# Altium project 16SoundsUSB.PrjPCB (part 1 of 2)
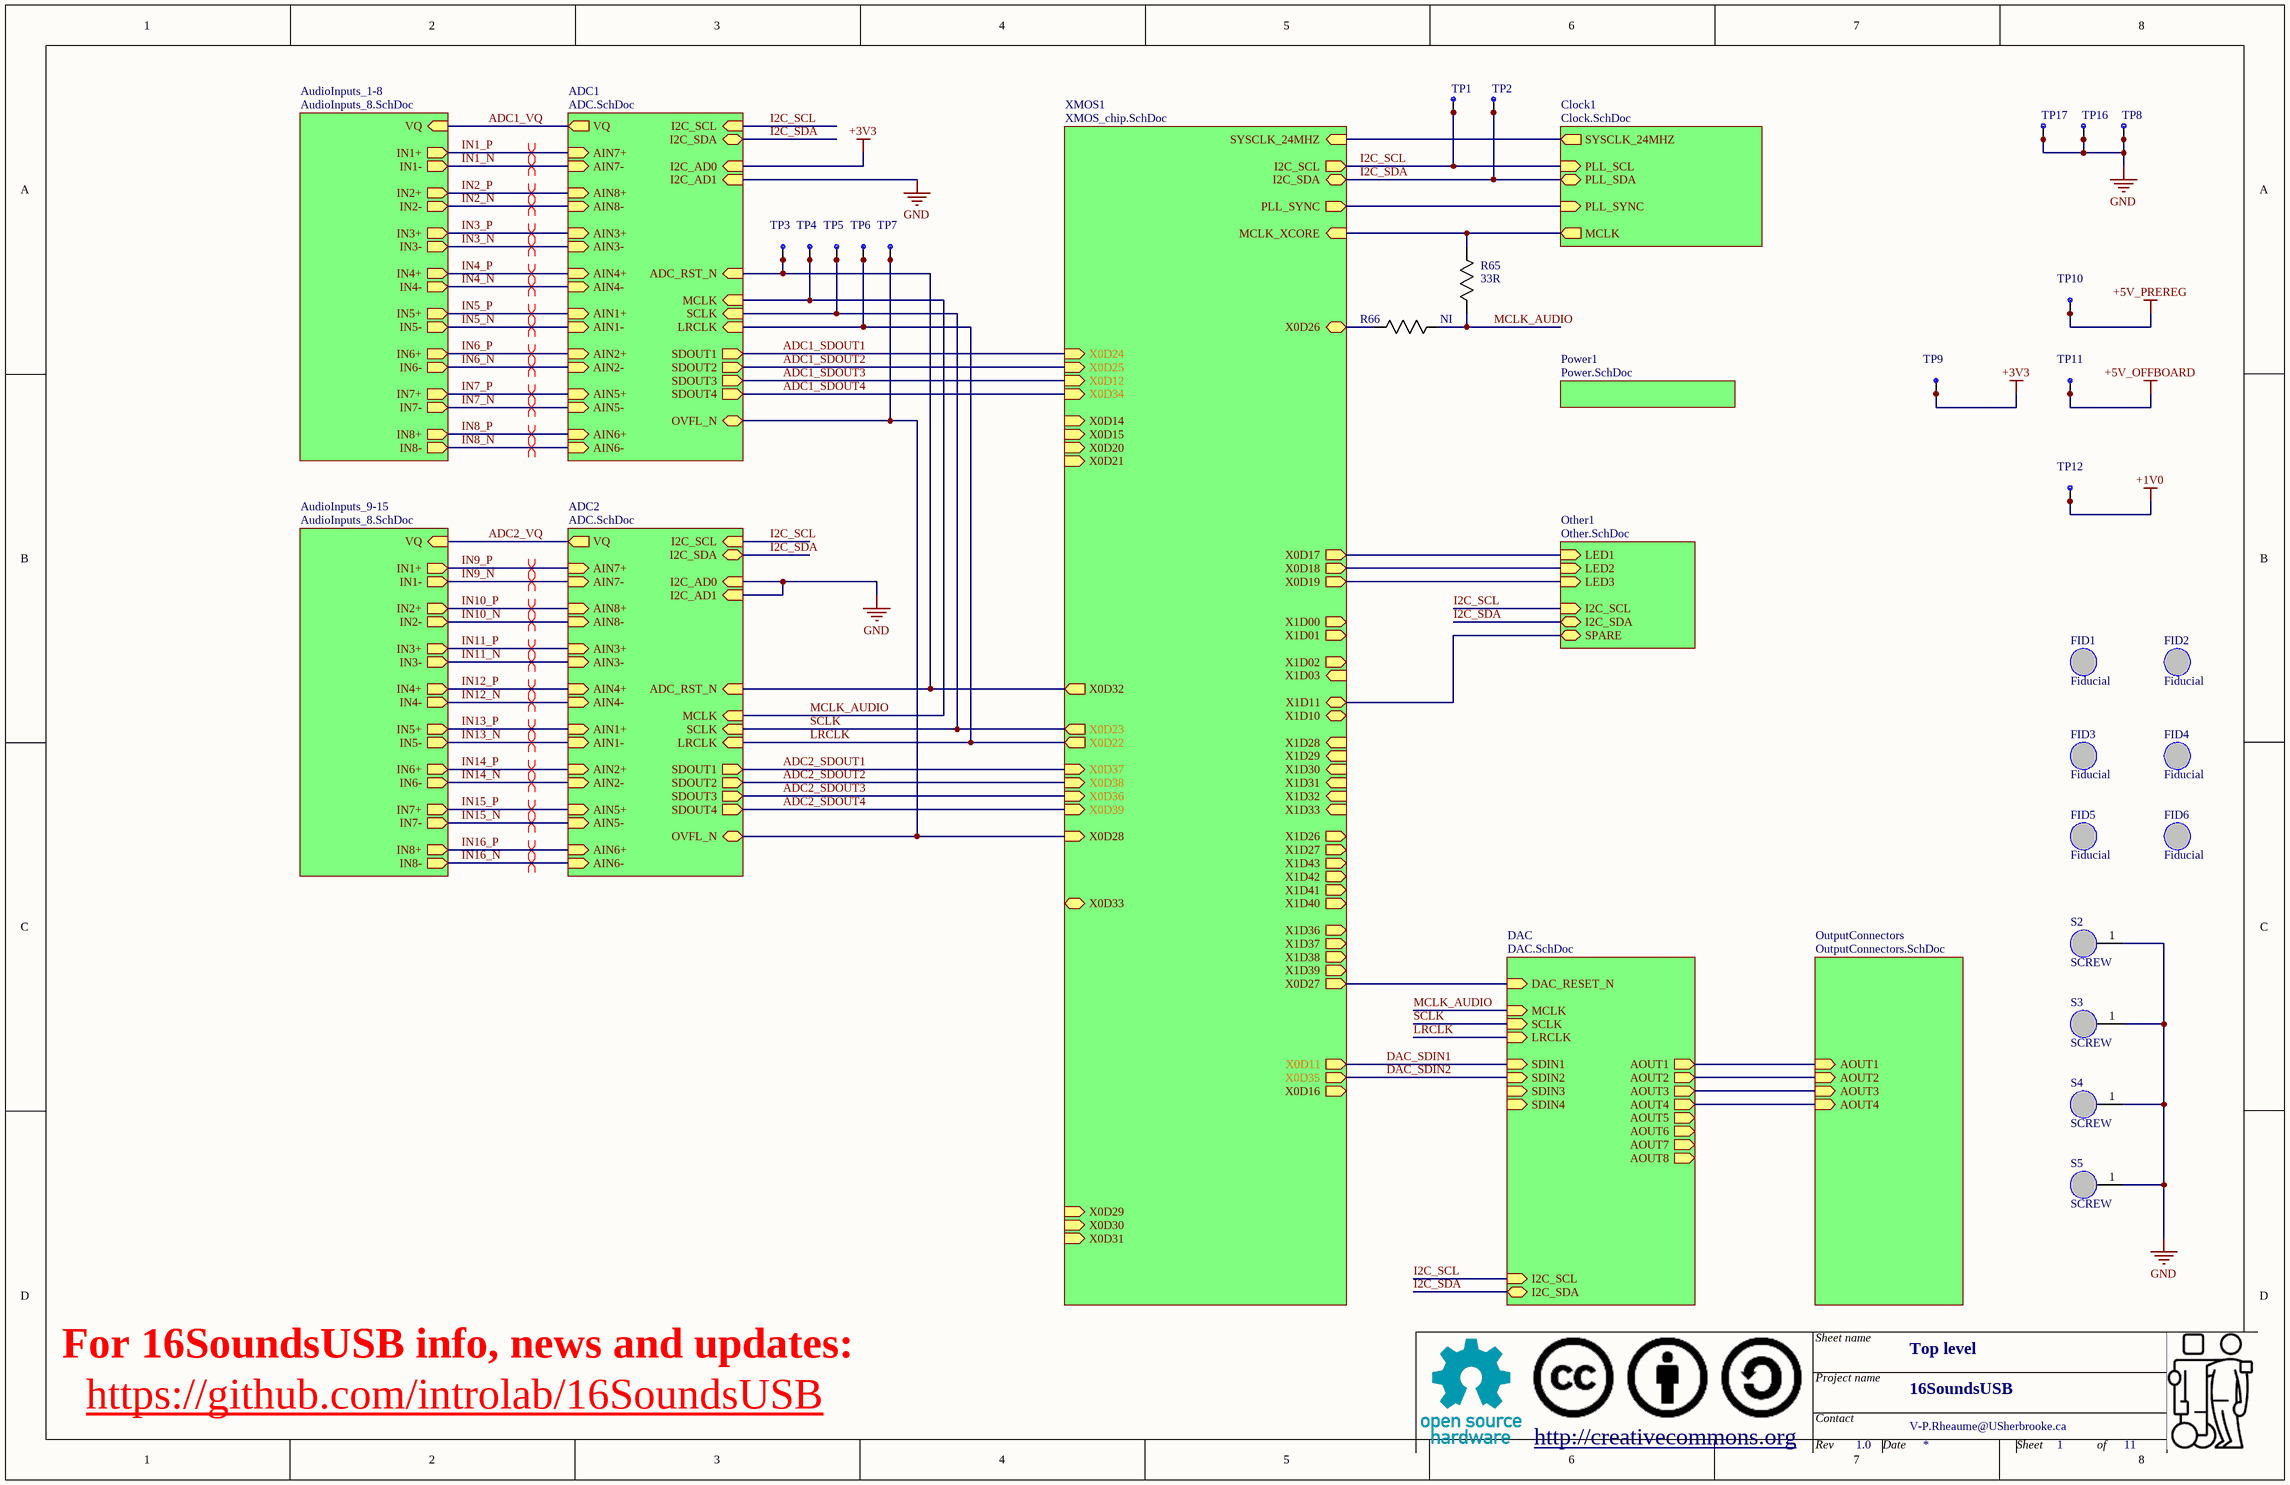
[diagram p0: TopLevel.SchDoc]
DrawnByGlobal: V-P.Rheaume@USherbrooke.ca; ProjectTitle: 16SoundsUSB; RevisionGlobal: 1.0
11 sheets, 583 parts. Net scope: hierarchical (ports join the sheet entries above them; power ports are global).
Board file: 16SoundsUSB.PcbDoc
Sheets:
  TopLevel.SchDoc
    Power1 = Power.SchDoc
    XMOS1 = XMOS_chip.SchDoc
      XMOS_power = XMOS_power.SchDoc
    AudioInputs_9-15 = AudioInputs_8.SchDoc
      InputAmplifier1 = InputAmplifier.SchDoc
      InputAmplifier2 = InputAmplifier.SchDoc
      InputAmplifier3 = InputAmplifier.SchDoc
      InputAmplifier4 = InputAmplifier.SchDoc
      InputAmplifier5 = InputAmplifier.SchDoc
      InputAmplifier6 = InputAmplifier.SchDoc
      InputAmplifier7 = InputAmplifier.SchDoc
      InputAmplifier8 = InputAmplifier.SchDoc
    Clock1 = Clock.SchDoc
    AudioInputs_1-8 = AudioInputs_8.SchDoc
      InputAmplifier1 = InputAmplifier.SchDoc
      InputAmplifier2 = InputAmplifier.SchDoc
      InputAmplifier3 = InputAmplifier.SchDoc
      InputAmplifier4 = InputAmplifier.SchDoc
      InputAmplifier5 = InputAmplifier.SchDoc
      InputAmplifier6 = InputAmplifier.SchDoc
      InputAmplifier7 = InputAmplifier.SchDoc
      InputAmplifier8 = InputAmplifier.SchDoc
    ADC2 = ADC.SchDoc
    ADC1 = ADC.SchDoc
    DAC = DAC.SchDoc
    OutputConnectors = OutputConnectors.SchDoc
    Other1 = Other.SchDoc

## Sheet TopLevel.SchDoc
size Tabloid; DrawnBy: V-P.Rheaume@USherbrooke.ca; DocumentNumber: 1; Revision: 1; SheetNumber: 1; SheetTotal: 11; SheetName: Top level

### Parts
FID1  Fiducial  [FIDUCIAL]
FID2  Fiducial  [FIDUCIAL]
FID3  Fiducial  [FIDUCIAL]
FID4  Fiducial  [FIDUCIAL]
FID5  Fiducial  [FIDUCIAL]
FID6  Fiducial  [FIDUCIAL]
R65  value 33R  [0603]  (hidden comment: Resistor)
R66  Resistor  [0603]  (value not drawn)
S2  SCREW  [SCREW_4_40]
S3  SCREW  [SCREW_4_40]
S4  SCREW  [SCREW_4_40]
S5  SCREW  [SCREW_4_40]
TP1  TESTPOINT  [0603]  (value not drawn)
TP2  TESTPOINT  [0603]  (value not drawn)
TP3  TESTPOINT  [0603]  (value not drawn)
TP4  TESTPOINT  [0603]  (value not drawn)
TP5  TESTPOINT  [0603]  (value not drawn)
TP6  TESTPOINT  [0603]  (value not drawn)
TP7  TESTPOINT  [0603]  (value not drawn)
TP8  TESTPOINT  [1206]  (value not drawn)
TP9  TESTPOINT  [0603]  (value not drawn)
TP10  TESTPOINT  [0603]  (value not drawn)
TP11  TESTPOINT  [0603]  (value not drawn)
TP12  TESTPOINT  [0603]  (value not drawn)
TP16  TESTPOINT  [1206]  (value not drawn)
TP17  TESTPOINT  [1206]  (value not drawn)

### Sub-sheets
ADC1 = ADC.SchDoc: I2C_SCL (in), I2C_SDA (bidir), I2C_AD1 (in), I2C_AD0 (in), SDOUT1 (out), SDOUT2 (out), SDOUT3 (out), SDOUT4 (out), LRCLK (in), SCLK (in), MCLK (in), ADC_RST_N (in), OVFL_N (bidir), AIN1+ (in), AIN1- (in), AIN2+ (in), AIN2- (in), AIN3+ (in), AIN3- (in), AIN4+ (in), AIN4- (in), AIN5+ (in), AIN5- (in), AIN6+ (in), AIN6- (in), AIN7+ (in), AIN7- (in), AIN8+ (in), AIN8- (in), VQ (out)
ADC2 = ADC.SchDoc: I2C_SCL (in), I2C_SDA (bidir), I2C_AD1 (in), I2C_AD0 (in), SDOUT1 (out), SDOUT2 (out), SDOUT3 (out), SDOUT4 (out), LRCLK (in), SCLK (in), MCLK (in), ADC_RST_N (in), OVFL_N (bidir), AIN1+ (in), AIN1- (in), AIN2+ (in), AIN2- (in), AIN3+ (in), AIN3- (in), AIN4+ (in), AIN4- (in), AIN5+ (in), AIN5- (in), AIN6+ (in), AIN6- (in), AIN7+ (in), AIN7- (in), AIN8+ (in), AIN8- (in), VQ (out)
AudioInputs_1-8 = AudioInputs_8.SchDoc: VQ (in), IN8+ (out), IN8- (out), IN1+ (out), IN1- (out), IN2+ (out), IN2- (out), IN3+ (out), IN3- (out), IN4+ (out), IN4- (out), IN5+ (out), IN5- (out), IN6+ (out), IN6- (out), IN7+ (out), IN7- (out)
AudioInputs_9-15 = AudioInputs_8.SchDoc: VQ (in), IN8+ (out), IN8- (out), IN1+ (out), IN1- (out), IN2+ (out), IN2- (out), IN3+ (out), IN3- (out), IN4+ (out), IN4- (out), IN5+ (out), IN5- (out), IN6+ (out), IN6- (out), IN7+ (out), IN7- (out)
Clock1 = Clock.SchDoc: SYSCLK_24MHZ (out), PLL_SYNC (in), PLL_SCL (in), PLL_SDA (bidir), MCLK (out)
DAC = DAC.SchDoc: LRCLK (in), SCLK (in), MCLK (in), SDIN1 (in), SDIN2 (in), SDIN3 (in), SDIN4 (in), DAC_RESET_N (in), I2C_SCL (in), I2C_SDA (bidir), AOUT1 (out), AOUT2 (out), AOUT3 (out), AOUT4 (out), AOUT5 (out), AOUT6 (out), AOUT7 (out), AOUT8 (out)
Other1 = Other.SchDoc: LED1 (in), LED2 (in), LED3 (in), I2C_SCL (in), I2C_SDA (bidir), SPARE (bidir)
OutputConnectors = OutputConnectors.SchDoc: AOUT1 (in), AOUT2 (in), AOUT3 (in), AOUT4 (in)
Power1 = Power.SchDoc: no entries
XMOS1 = XMOS_chip.SchDoc: SYSCLK_24MHZ (in), MCLK_XCORE (in), I2C_SCL (out), I2C_SDA (bidir), PLL_SYNC (out), X0D14 (in), X0D15 (in), X0D16 (out), X0D17 (out), X0D18 (out), X0D19 (out), X0D20 (in), X0D21 (in), X0D22 (out), X0D23 (out), X0D24 (in), X0D25 (in), X0D27 (out), X0D32 (out), X0D34 (in), X0D35 (out), X0D36 (in), X0D37 (in), X0D38 (in), X0D39 (in), X0D29 (in), X0D28 (in), X0D31 (in), X0D30 (in), X0D33 (bidir), X0D26 (bidir), X1D26 (out), X1D27 (out), X1D28 (in), X1D29 (in), X1D30 (in), X1D31 (in), X1D32 (in), X1D33 (in), X1D43 (out), X1D42 (out), X1D41 (out), X1D40 (out), X1D10 (bidir), X1D11 (bidir), X1D03 (in), X1D02 (out), X1D01 (out), X1D00 (out), X1D37 (out), X1D36 (out), X1D39 (out), X1D38 (out), X0D12 (in), X0D11 (out)

### Nets
+1V0: TP12.1 TP12.2
+3V3: TP9.1 TP9.2 ; sheet ADC1/I2C_AD0
+5V_OFFBOARD: TP11.1 TP11.2
+5V_PREREG: TP10.1 TP10.2
GND: S2.1 S3.1 S4.1 S5.1 TP8.1 TP8.2 TP16.1 TP16.2 TP17.1 TP17.2 ; sheet ADC2/I2C_AD1, sheet ADC2/I2C_AD0, sheet ADC1/I2C_AD1
ADC1_SDOUT1: sheet XMOS1/X0D24, sheet ADC1/SDOUT1
ADC1_SDOUT2: sheet XMOS1/X0D25, sheet ADC1/SDOUT2
ADC1_SDOUT3: sheet XMOS1/X0D12, sheet ADC1/SDOUT3
ADC1_SDOUT4: sheet XMOS1/X0D34, sheet ADC1/SDOUT4
ADC1_VQ: sheet AudioInputs_1-8/VQ, sheet ADC1/VQ
ADC2_SDOUT1: sheet XMOS1/X0D37, sheet ADC2/SDOUT1
ADC2_SDOUT2: sheet XMOS1/X0D38, sheet ADC2/SDOUT2
ADC2_SDOUT3: sheet XMOS1/X0D36, sheet ADC2/SDOUT3
ADC2_SDOUT4: sheet XMOS1/X0D39, sheet ADC2/SDOUT4
ADC2_VQ: sheet AudioInputs_9-15/VQ, sheet ADC2/VQ
DAC_SDIN1: sheet XMOS1/X0D11, sheet DAC/SDIN1
DAC_SDIN2: sheet XMOS1/X0D35, sheet DAC/SDIN2
I2C_SCL: TP1.1 TP1.2 ; sheet XMOS1/I2C_SCL, sheet Clock1/PLL_SCL, sheet ADC2/I2C_SCL, sheet ADC1/I2C_SCL, sheet DAC/I2C_SCL, sheet Other1/I2C_SCL
I2C_SDA: TP2.1 TP2.2 ; sheet XMOS1/I2C_SDA, sheet Clock1/PLL_SDA, sheet ADC2/I2C_SDA, sheet ADC1/I2C_SDA, sheet DAC/I2C_SDA, sheet Other1/I2C_SDA
IN1_N: sheet AudioInputs_1-8/IN1-, sheet ADC1/AIN7-
IN1_P: sheet AudioInputs_1-8/IN1+, sheet ADC1/AIN7+
IN2_N: sheet AudioInputs_1-8/IN2-, sheet ADC1/AIN8-
IN2_P: sheet AudioInputs_1-8/IN2+, sheet ADC1/AIN8+
IN3_N: sheet AudioInputs_1-8/IN3-, sheet ADC1/AIN3-
IN3_P: sheet AudioInputs_1-8/IN3+, sheet ADC1/AIN3+
IN4_N: sheet AudioInputs_1-8/IN4-, sheet ADC1/AIN4-
IN4_P: sheet AudioInputs_1-8/IN4+, sheet ADC1/AIN4+
IN5_N: sheet AudioInputs_1-8/IN5-, sheet ADC1/AIN1-
IN5_P: sheet AudioInputs_1-8/IN5+, sheet ADC1/AIN1+
IN6_N: sheet AudioInputs_1-8/IN6-, sheet ADC1/AIN2-
IN6_P: sheet AudioInputs_1-8/IN6+, sheet ADC1/AIN2+
IN7_N: sheet AudioInputs_1-8/IN7-, sheet ADC1/AIN5-
IN7_P: sheet AudioInputs_1-8/IN7+, sheet ADC1/AIN5+
IN8_N: sheet AudioInputs_1-8/IN8-, sheet ADC1/AIN6-
IN8_P: sheet AudioInputs_1-8/IN8+, sheet ADC1/AIN6+
IN9_N: sheet AudioInputs_9-15/IN1-, sheet ADC2/AIN7-
IN9_P: sheet AudioInputs_9-15/IN1+, sheet ADC2/AIN7+
IN10_N: sheet AudioInputs_9-15/IN2-, sheet ADC2/AIN8-
IN10_P: sheet AudioInputs_9-15/IN2+, sheet ADC2/AIN8+
IN11_N: sheet AudioInputs_9-15/IN3-, sheet ADC2/AIN3-
IN11_P: sheet AudioInputs_9-15/IN3+, sheet ADC2/AIN3+
IN12_N: sheet AudioInputs_9-15/IN4-, sheet ADC2/AIN4-
IN12_P: sheet AudioInputs_9-15/IN4+, sheet ADC2/AIN4+
IN13_N: sheet AudioInputs_9-15/IN5-, sheet ADC2/AIN1-
IN13_P: sheet AudioInputs_9-15/IN5+, sheet ADC2/AIN1+
IN14_N: sheet AudioInputs_9-15/IN6-, sheet ADC2/AIN2-
IN14_P: sheet AudioInputs_9-15/IN6+, sheet ADC2/AIN2+
IN15_N: sheet AudioInputs_9-15/IN7-, sheet ADC2/AIN5-
IN15_P: sheet AudioInputs_9-15/IN7+, sheet ADC2/AIN5+
IN16_N: sheet AudioInputs_9-15/IN8-, sheet ADC2/AIN6-
IN16_P: sheet AudioInputs_9-15/IN8+, sheet ADC2/AIN6+
LRCLK: TP6.1 TP6.2 ; sheet XMOS1/X0D22, sheet ADC2/LRCLK, sheet ADC1/LRCLK, sheet DAC/LRCLK
MCLK_AUDIO: R65.1 R66.2 TP4.1 TP4.2 ; sheet ADC2/MCLK, sheet ADC1/MCLK, sheet DAC/MCLK
MCLK_XCORE: R65.2 ; sheet XMOS1/MCLK_XCORE, sheet Clock1/MCLK
SCLK: TP5.1 TP5.2 ; sheet XMOS1/X0D23, sheet ADC2/SCLK, sheet ADC1/SCLK, sheet DAC/SCLK
NetC36_+: sheet DAC/AOUT1, sheet OutputConnectors/AOUT1
NetC37_+: sheet DAC/AOUT3, sheet OutputConnectors/AOUT3
NetC40_+: sheet DAC/AOUT2, sheet OutputConnectors/AOUT2
NetC41_+: sheet DAC/AOUT4, sheet OutputConnectors/AOUT4
NetP19_5: sheet XMOS1/X1D11, sheet Other1/SPARE
NetR7_ADC1_2: TP7.1 TP7.2 ; sheet XMOS1/X0D28, sheet ADC2/OVFL_N, sheet ADC1/OVFL_N
NetR8_1: sheet XMOS1/X0D19, sheet Other1/LED3
NetR10_1: sheet XMOS1/X0D18, sheet Other1/LED2
NetR17_2: sheet XMOS1/SYSCLK_24MHZ, sheet Clock1/SYSCLK_24MHZ
NetR45_1: sheet XMOS1/X0D17, sheet Other1/LED1
NetR66_1: R66.1 ; sheet XMOS1/X0D26
NetTP3_1: TP3.1 TP3.2 ; sheet XMOS1/X0D32, sheet ADC2/ADC_RST_N, sheet ADC1/ADC_RST_N
NetU2_5: sheet XMOS1/PLL_SYNC, sheet Clock1/PLL_SYNC
NetU4_94: sheet XMOS1/X0D27, sheet DAC/DAC_RESET_N

Not connected (* = marked no-connect by the designer): FID1 0; FID2 0; FID3 0; FID4 0; FID5 0; FID6 0

### Layout directives
differential pair: IN1_N, IN1_P, IN2_N, IN2_P, IN3_N, IN3_P, IN4_N, IN4_P, IN5_N, IN5_P, IN6_N, IN6_P, IN7_N, IN7_P, IN8_N, IN8_P, IN9_N, IN9_P, IN10_N, IN10_P, IN11_N, IN11_P, IN12_N, IN12_P, IN13_N, IN13_P, IN14_N, IN14_P, IN15_N, IN15_P, IN16_N, IN16_P

### Notes on the sheet
- For 16SoundsUSB info, news and updates:
- https://github.com/introlab/16SoundsUSB
- Sheet name
- http://creativecommons.org
- Project name
- Contact
- Rev
- Date
- Sheet
- of

### Library data of the parts
R65 = Resistor: Mfg: Yageo; Mfg_PN: RC0603JR-0733RL; HelpURL: *; NI: *; Supplier1: Digikey; Supplier1_PN: 311-33GRCT-ND; Type: *; Rating: *; Tolerance: *
R66 = Resistor: Mfg: Yageo; Mfg_PN: RC0603JR-0733RL; Value: 33R; HelpURL: *; NI: NI; Supplier1: Digikey; Supplier1_PN: 311-33GRCT-ND; Type: *; Rating: *; Tolerance: *
S2-S5 = SCREW: Screw hole; HelpURL: *; Mfg: *; Mfg_PN: *; NI: NI; Rating: *; Supplier1: *; Supplier1_PN: *; Tolerance: *; Type: *; Value: *
TP1-TP7 TP9-TP12 = TESTPOINT: Test point; Mfg: TE; Mfg_PN: RCU-0C; HelpURL: *; NI: *; Rating: *; Supplier1: Digikey; Supplier1_PN: A106145CT-ND; Tolerance: *; Type: *; Value: *
TP8 TP16 TP17 = TESTPOINT: Test point; Mfg: Harwin; Mfg_PN: S1751-46; HelpURL: *; NI: *; Rating: *; Supplier1: Digikey; Supplier1_PN: 952-3024-ND; Tolerance: *; Type: *; Value: *
FID1-FID6 = Fiducial: HelpURL: *; Mfg: *; Mfg_PN: *; NI: NI; Rating: *; Supplier1: *; Supplier1_PN: *; Tolerance: *; Type: *; Value: *

## Sheet Power.SchDoc
size Tabloid; DocumentNumber: 2; SheetNumber: 2; SheetTotal: 11; SheetName: Main power supply
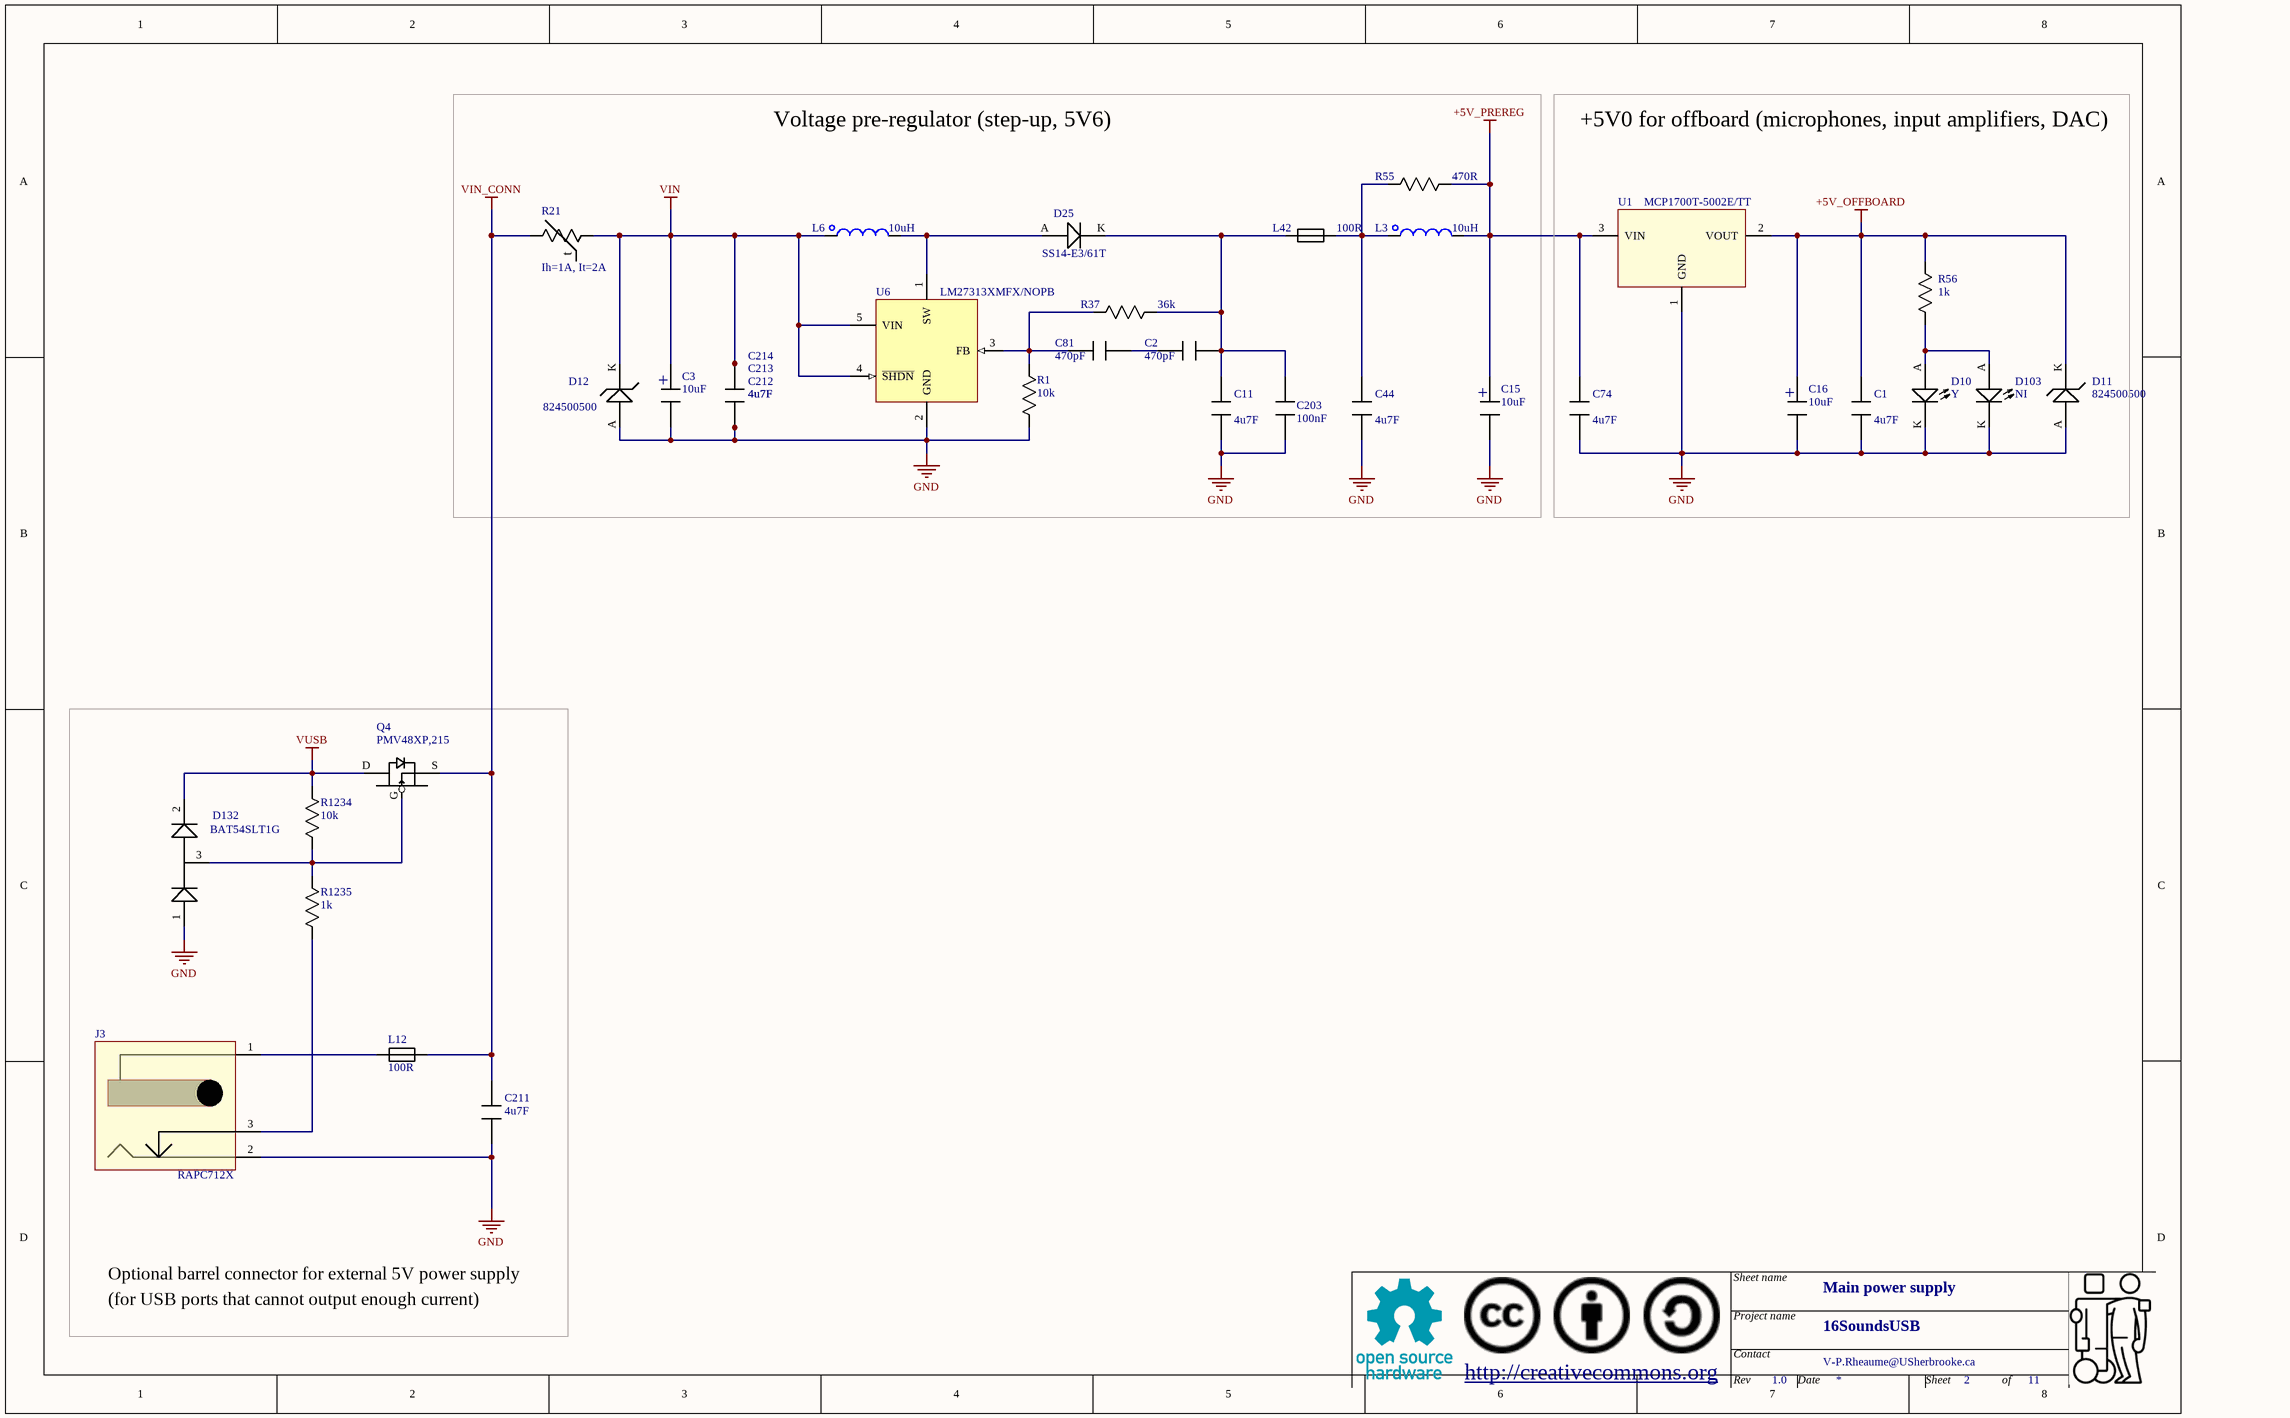
[diagram p1: Power.SchDoc]

### Parts
(Parts that share a designator on the sheet are numbered #1, #2 ... from top to bottom, then left to right.)
C1  value 4u7F  [0805]  (hidden comment: Capacitor)
C2  value 470pF  [0603]  (hidden comment: Capacitor)
C3  value 10uF  [CAP_RAD_SMD_DIA157]  (hidden comment: Capacitor_Polarized)
C11  value 4u7F  [0805]  (hidden comment: Capacitor)
C15  value 10uF  [CAP_RAD_SMD_DIA157]  (hidden comment: Capacitor_Polarized)
C16  value 10uF  [CAP_RAD_SMD_DIA157]  (hidden comment: Capacitor_Polarized)
C44  value 4u7F  [0805]  (hidden comment: Capacitor)
C74  value 4u7F  [0805]  (hidden comment: Capacitor)
C81  value 470pF  [0603]  (hidden comment: Capacitor)
C203  value 100nF  [0603]  (hidden comment: Capacitor)
C211  value 4u7F  [0805]  (hidden comment: Capacitor)
C212  value 4u7F  [0805]  (hidden comment: Capacitor)
C213  value 4u7F  [0805]  (hidden comment: Capacitor)
C214  value 4u7F  [0805]  (hidden comment: Capacitor)
D10  Type: Y  [0805_LED]  (hidden comment: Diode_LED)
D11  Mfg_PN: 824500500  [DIODE_DO-214AC/SMA]  (hidden comment: Diode_zener)
D12  Mfg_PN: 824500500  [DIODE_DO-214AC/SMA]  (hidden comment: Diode_zener)
D25  Mfg_PN: SS14-E3/61T  [DIODE_SMA]  (hidden comment: Diode)
D103  Diode_LED  [0805_LED]  (value not drawn)
D132  Mfg_PN: BAT54SLT1G  [SOT23_132]  (hidden comment: Diode_dual)
J3  Mfg_PN: RAPC712X  [CONN_2.5mmID5.5mmOD_RAPC712X]  (hidden comment: CON_POWER_RAPC712X)
L3  value 10uH  [IND_252012CDMC/DS]  (hidden comment: Inductor)
L6  value 10uH  [IND_252012CDMC/DS]  (hidden comment: Inductor)
L12  value 100R  [0805]  (hidden comment: Ferrite)
L42  value 100R  [0805]  (hidden comment: Ferrite)
Q4#1  Mfg_PN: PMV48XP,215  [SOT23_GDS]  (hidden comment: MOSFET_P_GDS)
R1  value 10k  [0603]  (hidden comment: Resistor)
R21  value Ih=1A, It=2A  [0805]  (hidden comment: Resistor_PTC)
R37  value 36k  [0603]  (hidden comment: Resistor)
R55  value 470R  [0603]  (hidden comment: Resistor)
R56  value 1k  [0603]  (hidden comment: Resistor)
R1234  value 10k  [0603]  (hidden comment: Resistor)
R1235  value 1k  [0603]  (hidden comment: Resistor)
U1  Mfg_PN: MCP1700T-5002E/TT  [SOT23_132]  (hidden comment: MCP1700)
U6  LM27313XMFX/NOPB  [MF05A_N]

### Blocks framed on the sheet
Voltage pre-regulator (step-up, 5V6): C2 C3 C11 C15 C44 C81 C203 C212-C214 D12 D25 L3 L6 L42 R1 R21 R37 R55 U6
+5V0 for offboard (microphones, input amplifiers, DAC): C1 C16 C74 D10 D11 D103 R56 U1

### Nets
+5V_OFFBOARD: C1.1 C16.+ D11.K R56.2 U1.2(VOUT)
+5V_PREREG: C15.+ C74.1 L3.2 R55.1 U1.3(VIN)
GND: C1.2 C3.- C11.2 C15.- C16.- C44.2 C74.2 C203.2 C211.2 C212.2 C213.2 C214.2 D10.K D11.A D12.A D103.K D132.1(K) J3.2(GROUND) R1.2 U1.1(GND) U6.2(GND)
VIN: C3.+ C212.1 C213.1 C214.1 D12.K L6.1 R21.2 U6.4(~{SHDN}) U6.5(VIN)
VIN_CONN: C211.1 L12.2 Q4#1.S R21.1
VUSB: D132.2(K) Q4#1.D R1234.2
NetC2_1: C2.1 C81.2
NetC2_2: C2.2 C11.1 C203.1 D25.K L42.1 R37.2
NetC44_1: C44.1 L3.1 L42.2 R55.2
NetC81_1: C81.1 R1.1 R37.1 U6.3(FB)
NetD10_A: D10.A D103.A R56.1
NetD25_A: D25.A L6.2 U6.1(SW)
NetD132_3: D132.3(AK) Q4#1.G R1234.1 R1235.2
NetJ3_1: J3.1(CENTER) L12.1
NetJ3_3: J3.3(SW/BATT) R1235.1

### Notes on the sheet
- Optional barrel connector for external 5V power supply
- (for USB ports that cannot output enough current)
- Sheet name
- http://creativecommons.org
- Project name
- Contact
- Rev
- Date
- Sheet
- of
- (in symbol Resistor_PTC) t

### Library data of the parts
C1 C11 C44 C74 C211-C214 = Capacitor: Mfg: Samsung; Mfg_PN: CL21A475KAQNNNG; HelpURL: *; NI: *; Supplier1: Digikey; Supplier1_PN: 1276-6462-1-ND; Tolerance: *; Type: *; Rating: *
C2 C81 = Capacitor: Mfg: Samsung; Mfg_PN: CL10C471JB8NCNC; HelpURL: *; NI: *; Supplier1: Digikey; Supplier1_PN: 1276-2302-1-ND; Tolerance: *; Type: *; Rating: *
C3 C15 C16 = Capacitor_Polarized: Capacitor; Mfg: Nichicon; Mfg_PN: UWX1C100MCL1GB; HelpURL: *; NI: *; Supplier1: Digikey; Supplier1_PN: 493-2100-1-ND; Tolerance: *; Type: *; Rating: *
C203 = Capacitor: Mfg: Samsung; Mfg_PN: CL10F104ZO8NNNC; HelpURL: *; NI: NI; Supplier1: Digikey; Supplier1_PN: 1276-1258-1-ND; Tolerance: *; Type: *; Rating: *
D10 = Diode_LED: LED; Mfg: Osram; Mfg_PN: LY R976-PS-36; HelpURL: *; NI: *; Supplier1: Digikey; Supplier1_PN: 475-2560-1-ND; Tolerance: *; Rating: *; Value: *
D11 D12 = Diode_zener: Diode; Mfg: Wurth; HelpURL: *; NI: *; Supplier1: Digikey; Supplier1_PN: 732-9974-1-ND; Tolerance: *; Type: *; Rating: *; Value: *
D25 = Diode: Mfg: Vishay; HelpURL: *; NI: *; Supplier1: Digikey; Supplier1_PN: SS14-E3/61TGICT-ND; Tolerance: *; Type: *; Rating: *; Value: *
D103 = Diode_LED: LED; Type: G; HelpURL: *; Mfg: *; Mfg_PN: *; NI: NI; Supplier1: *; Supplier1_PN: *; Tolerance: *; Rating: *; Value: *
D132 = Diode_dual: Diode; Mfg: Onsemi; HelpURL: *; NI: *; Supplier1: Digikey; Supplier1_PN: BAT54SLT1GOSCT-ND; Tolerance: *; Type: *; Rating: *; Value: *
J3 = CON_POWER_RAPC712X: Power barrel connector, through-hole, 2.5mm ID,; Mfg: Switchcraft Inc.; HelpURL: *; NI: *; Rating: *; Supplier1: Digikey; Supplier1_PN: SC237-ND; Tolerance: *; Type: *; Value: *
L3 L6 = Inductor: Mfg: Murata; Mfg_PN: DFE252012F-100M=P2; HelpURL: *; NI: *; Rating: *; Tolerance: *; Supplier1: Digikey; Supplier1_PN: 490-13050-1-ND
L12 L42 = Ferrite: Mfg: Bourns; Mfg_PN: MH2029-101Y; Rating: 1A; HelpURL: *; NI: *; Supplier1: Digikey; Supplier1_PN: MH2029-101YCT-ND; Tolerance: *; Type: *
Q4#1 = MOSFET_P_GDS: PMOS; Mfg: NXP; HelpURL: *; NI: *; Rating: *; Supplier1: Digikey; Supplier1_PN: 568-7579-1-ND; Tolerance: *; Type: *; Value: *
R1 R1234 = Resistor: Mfg: Yageo; Mfg_PN: RC0603JR-0710KL; HelpURL: *; NI: *; Supplier1: Digikey; Supplier1_PN: 311-10KGRCT-ND; Type: *; Rating: *; Tolerance: *
R21 = Resistor_PTC: Mfg: Bel fuse; Mfg_PN: 0ZCK0100FF2E; HelpURL: *; NI: *; Supplier1: Digikey; Supplier1_PN: 507-1815-1-ND; Type: *; Rating: *; Tolerance: *
R37 = Resistor: Mfg: Yageo; Mfg_PN: RC0603JR-0736KL; HelpURL: *; NI: *; Supplier1: Digikey; Supplier1_PN: 311-36KGRCT-ND; Type: *; Rating: *; Tolerance: *
R55 = Resistor: Mfg: Yageo; Mfg_PN: RC0603JR-07470RL; HelpURL: *; NI: *; Supplier1: Digikey; Supplier1_PN: 311-470GRCT-ND; Type: *; Rating: *; Tolerance: *
R56 R1235 = Resistor: Mfg: Yageo; Mfg_PN: RC0603JR-071KL; HelpURL: *; NI: *; Supplier1: Digikey; Supplier1_PN: 311-1.0KGRCT-ND; Type: *; Rating: *; Tolerance: *
U1 = MCP1700: Linear voltage regulator; Mfg: Microchip; HelpURL: http://ww1.microchip.com/downloads/en/DeviceDoc/20001826C.pdf; NI: *; Supplier1: Digikey; Supplier1_PN: MCP1700T5002ETTCT-ND; Type: *
U6 = LM27313XMFX/NOPB: 1.6 MHz Boost Converter With 30V Internal FET Switch, 5-pin SOT-23, Pb-Free, 3000 Reel; Mfg: TI; Mfg_PN: LM27313XMF/NOPB; Supplier1: Digikey; Supplier1_PN: LM27313XMF/NOPBCT-ND

## Sheet XMOS_chip.SchDoc
size Tabloid; DocumentNumber: 5; SheetNumber: 5; SheetTotal: 11; SheetName: XMOS processor
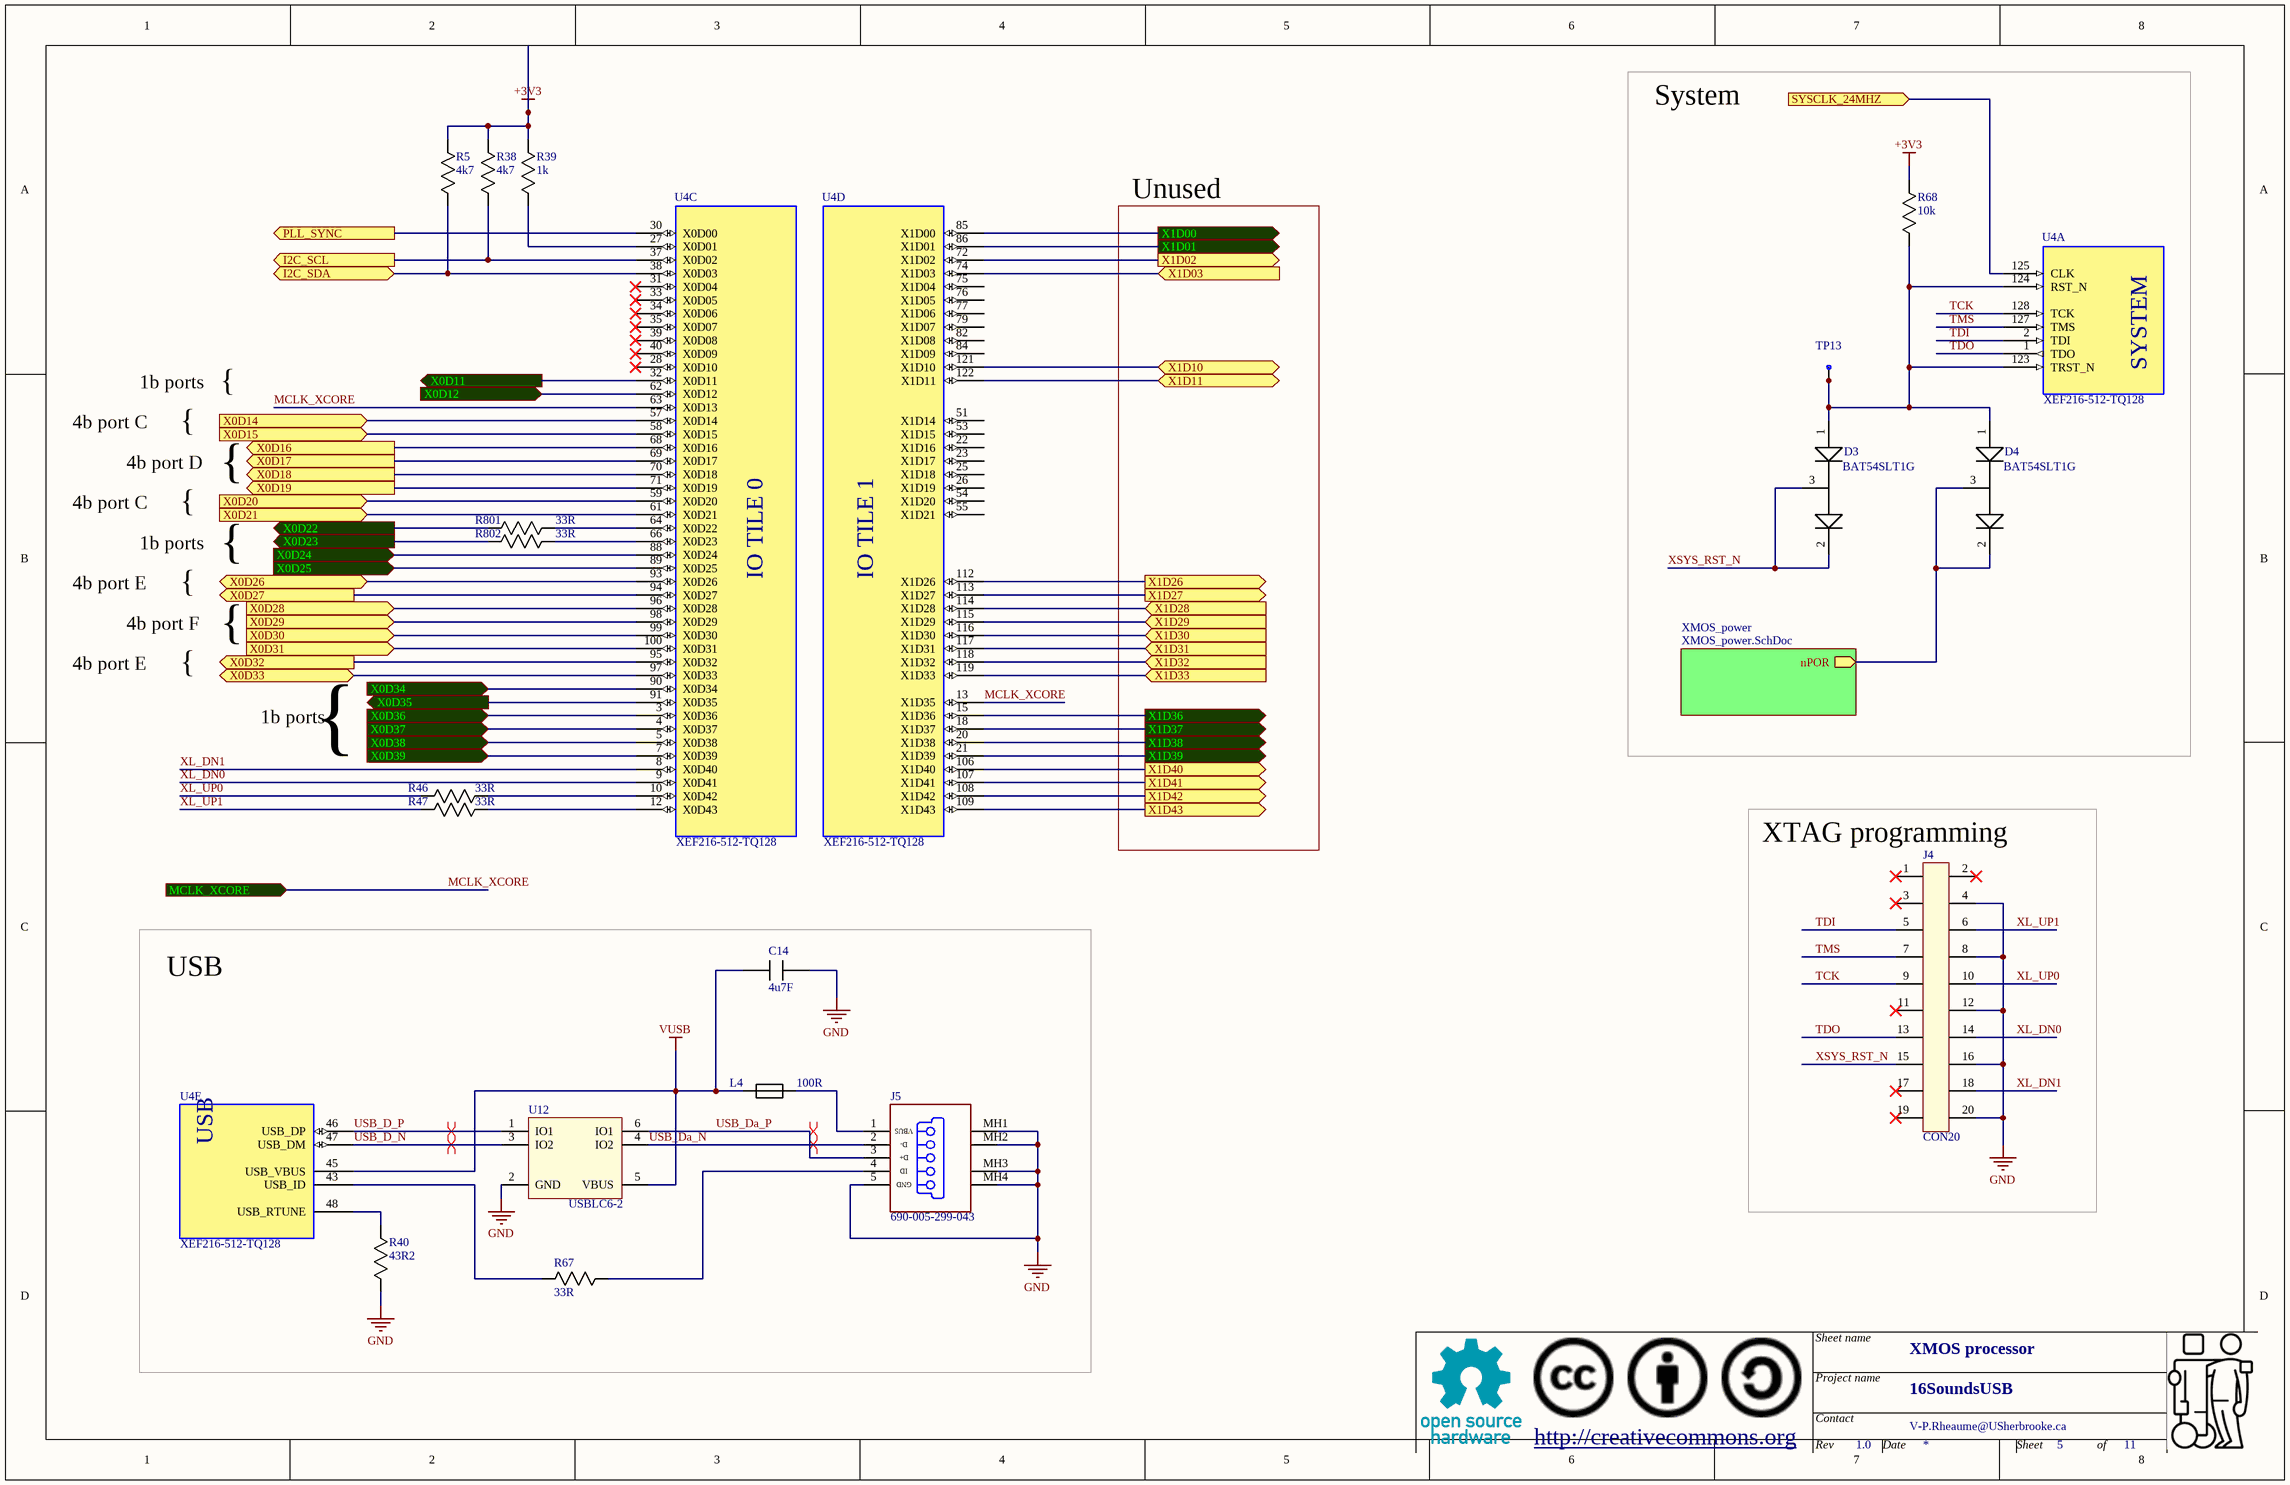
[diagram p2: XMOS_chip.SchDoc]

### Parts
C14  value 4u7F  [0805]  (hidden comment: Capacitor)
D3  Mfg_PN: BAT54SLT1G  [SOT23_132]  (hidden comment: Diode_dual)
D4  Mfg_PN: BAT54SLT1G  [SOT23_132]  (hidden comment: Diode_dual)
J4  CON20  [CONN20_100mils_pol_SMD]
J5  Mfg_PN: 690-005-299-043  [CONN_USB_MINIB_690-005-299-043]  (hidden comment: USB_MINIB_690-005-299-043)
L4  value 100R  [0805]  (hidden comment: Ferrite)
R5  value 4k7  [0603]  (hidden comment: Resistor)
R38  value 4k7  [0603]  (hidden comment: Resistor)
R39  value 1k  [0603]  (hidden comment: Resistor)
R40  value 43R2  [0603]  (hidden comment: Resistor)
R46  value 33R  [0603]  (hidden comment: Resistor)
R47  value 33R  [0603]  (hidden comment: Resistor)
R67  value 33R  [0603]  (hidden comment: Resistor)
R68  value 10k  [0603]  (hidden comment: Resistor)
R801  value 33R  [0603]  (hidden comment: Resistor)
R802  value 33R  [0603]  (hidden comment: Resistor)
TP13  TESTPOINT  [0603]  (value not drawn)
U4  Mfg_PN: XEF216-512-TQ128  [TQFP128_XMOS]  (parts A,C,D,E of 5)
U12  USBLC6-2  [USBLC6-2]

### Blocks framed on the sheet
System: D3 D4 R68 TP13 U4
XTAG programming: J4
USB: C14 J5 L4 R40 R67 U4 U12

### Sub-sheets
XMOS_power = XMOS_power.SchDoc: nPOR (out)

### Ports
I2C_SCL (out), I2C_SDA (bidir), MCLK_XCORE (in), PLL_SYNC (out), SYSCLK_24MHZ (in), X0D11 (out), X0D12 (in), X0D14 (in), X0D15 (in), X0D16 (out), X0D17 (out), X0D18 (out), X0D19 (out), X0D20 (in), X0D21 (in), X0D22 (out), X0D23 (out), X0D24 (in), X0D25 (in), X0D26 (bidir), X0D27 (out), X0D28 (in), X0D29 (in), X0D30 (in), X0D31 (in), X0D32 (out), X0D33 (bidir), X0D34 (in), X0D35 (out), X0D36 (in), X0D37 (in), X0D38 (in), X0D39 (in), X1D00 (out), X1D01 (out), X1D02 (out), X1D03 (in), X1D10 (bidir), X1D11 (bidir), X1D26 (out), X1D27 (out), X1D28 (in), X1D29 (in), X1D30 (in), X1D31 (in), X1D32 (in), X1D33 (in), X1D36 (out), X1D37 (out), X1D38 (out), X1D39 (out), X1D40 (out), X1D41 (out), X1D42 (out), X1D43 (out)

### Nets
+3V3: R5.1 R38.1 R39.1 R68.1
GND: C14.2 J4.4 J4.8 J4.12 J4.16 J4.20 J5.5(GND) J5.MH1(Tab) J5.MH2(Tab) J5.MH3(Tab) J5.MH4(Tab) R40.1 U12.2(GND)
VUSB: C14.1 L4.1 U4.45(USB_VBUS) U12.5(VBUS)
ADC1_SDOUT1: U4.88(X0D24) ; port X0D24
ADC1_SDOUT2: U4.89(X0D25) ; port X0D25
ADC1_SDOUT3: U4.62(X0D12) ; port X0D12
ADC1_SDOUT4: U4.90(X0D34) ; port X0D34
ADC2_SDOUT1: U4.4(X0D37) ; port X0D37
ADC2_SDOUT2: U4.5(X0D38) ; port X0D38
ADC2_SDOUT3: U4.3(X0D36) ; port X0D36
ADC2_SDOUT4: U4.7(X0D39) ; port X0D39
DAC_SDIN1: U4.32(X0D11) ; port X0D11
DAC_SDIN2: U4.91(X0D35) ; port X0D35
I2C_SCL: R38.2 U4.37(X0D02) ; port I2C_SCL
I2C_SDA: R5.2 U4.38(X0D03) ; port I2C_SDA
LRCLK: R801.1 ; port X0D22
MCLK_XCORE: U4.13(X1D35) U4.63(X0D13) ; port MCLK_XCORE
SCLK: R802.1 ; port X0D23
TCK: J4.9 U4.128(TCK)
TDI: J4.5 U4.2(TDI)
TDO: J4.13 U4.1(TDO)
TMS: J4.7 U4.127(TMS)
USB_D_N: U4.47(USB_DM) U12.3(IO2)
USB_D_P: U4.46(USB_DP) U12.1(IO1)
USB_Da_N: J5.2(D-) U12.4(IO2)
USB_Da_P: J5.3(D+) U12.6(IO1)
XL_DN0: J4.14 U4.9(X0D41)
XL_DN1: J4.18 U4.8(X0D40)
XL_UP0: J4.10 R46.1
XL_UP1: J4.6 R47.1
XSYS_RST_N: D3.2(K) D3.3(AK) J4.15
NetD3_1: D3.1(K) D4.1(K) R68.2 TP13.1 TP13.2 U4.123(TRST_N) U4.124(RST_N)
NetD4_2: D4.2(K) D4.3(AK) ; sheet XMOS_power/nPOR
NetJ5_1: J5.1(V_BUS_(5V)) L4.2
NetJ5_4: J5.4(NC) R67.1
NetP19_5: U4.122(X1D11) ; port X1D11
NetR7_ADC1_2: U4.96(X0D28) ; port X0D28
NetR8_1: U4.71(X0D19) ; port X0D19
NetR10_1: U4.70(X0D18) ; port X0D18
NetR17_2: U4.125(CLK) ; port SYSCLK_24MHZ
NetR39_2: R39.2 U4.27(X0D01)
NetR40_2: R40.2 U4.48(USB_RTUNE)
NetR45_1: U4.69(X0D17) ; port X0D17
NetR46_2: R46.2 U4.10(X0D42)
NetR47_2: R47.2 U4.12(X0D43)
NetR66_1: U4.93(X0D26) ; port X0D26
NetR67_2: R67.2 U4.43(USB_ID)
NetR801_2: R801.2 U4.64(X0D22)
NetR802_2: R802.2 U4.66(X0D23)
NetTP3_1: U4.95(X0D32) ; port X0D32
NetU2_5: U4.30(X0D00) ; port PLL_SYNC
NetU4_15: U4.15(X1D36) ; port X1D36
NetU4_18: U4.18(X1D37) ; port X1D37
NetU4_20: U4.20(X1D38) ; port X1D38
NetU4_21: U4.21(X1D39) ; port X1D39
NetU4_57: U4.57(X0D14) ; port X0D14
NetU4_58: U4.58(X0D15) ; port X0D15
NetU4_59: U4.59(X0D20) ; port X0D20
NetU4_61: U4.61(X0D21) ; port X0D21
NetU4_68: U4.68(X0D16) ; port X0D16
NetU4_72: U4.72(X1D02) ; port X1D02
NetU4_74: U4.74(X1D03) ; port X1D03
NetU4_85: U4.85(X1D00) ; port X1D00
NetU4_86: U4.86(X1D01) ; port X1D01
NetU4_94: U4.94(X0D27) ; port X0D27
NetU4_97: U4.97(X0D33) ; port X0D33
NetU4_98: U4.98(X0D29) ; port X0D29
NetU4_99: U4.99(X0D30) ; port X0D30
NetU4_100: U4.100(X0D31) ; port X0D31
NetU4_106: U4.106(X1D40) ; port X1D40
NetU4_107: U4.107(X1D41) ; port X1D41
NetU4_108: U4.108(X1D42) ; port X1D42
NetU4_109: U4.109(X1D43) ; port X1D43
NetU4_112: U4.112(X1D26) ; port X1D26
NetU4_113: U4.113(X1D27) ; port X1D27
NetU4_114: U4.114(X1D28) ; port X1D28
NetU4_115: U4.115(X1D29) ; port X1D29
NetU4_116: U4.116(X1D30) ; port X1D30
NetU4_117: U4.117(X1D31) ; port X1D31
NetU4_118: U4.118(X1D32) ; port X1D32
NetU4_119: U4.119(X1D33) ; port X1D33
NetU4_121: U4.121(X1D10) ; port X1D10

Not connected (* = marked no-connect by the designer): J4 1* 2* 3* 11* 17* 19*; U4 22(X1D16) 23(X1D17) 25(X1D18) 26(X1D19) 28(X0D10)* 31(X0D04)* 33(X0D05)* 34(X0D06)* 35(X0D07)* 39(X0D08)* 40(X0D09)* 51(X1D14) 53(X1D15) 54(X1D20) 55(X1D21) 75(X1D04) 76(X1D05) 77(X1D06) 79(X1D07) 82(X1D08) 84(X1D09)

### Layout directives
differential pair: USB_D_N, USB_D_P, USB_Da_N, USB_Da_P

### Notes on the sheet
- Unused
- 4b port C
- 1b ports
- {
- 4b port D
- 4b port E
- 4b port F
- Sheet name
- http://creativecommons.org
- Project name
- Contact
- Rev
- Date
- Sheet
- of
- (in symbol USB_MINIB_690-005-299-043) VBUS; ID
- (in symbol XMOS_XEF216-512-TQ128, part A) SYSTEM
- (in symbol XMOS_XEF216-512-TQ128, part C) IO TILE 0
- (in symbol XMOS_XEF216-512-TQ128, part D) IO TILE 1
- (in symbol XMOS_XEF216-512-TQ128, part E) USB

### Library data of the parts
C14 = Capacitor: Mfg: Samsung; Mfg_PN: CL21A475KAQNNNG; HelpURL: *; NI: *; Supplier1: Digikey; Supplier1_PN: 1276-6462-1-ND; Tolerance: *; Type: *; Rating: *
D3 D4 = Diode_dual: Diode; Mfg: Onsemi; HelpURL: *; NI: *; Supplier1: Digikey; Supplier1_PN: BAT54SLT1GOSCT-ND; Tolerance: *; Type: *; Rating: *; Value: *
J4 = CON20: 20-pins; Mfg: CNC Tech; Mfg_PN: 3020-20-0300-00; HelpURL: *; NI: *; Rating: *; Supplier1: Digikey; Supplier1_PN: 1175-1623-ND; Tolerance: *; Type: *; Value: *
J5 = USB_MINIB_690-005-299-043: USB On-The-Go (OTG) Mini-B Receptacle, Right Angle, SMT, 0.80mm (.031") Pitch, Solder Tabs with Back Cover, Recessed Type; Mfg: EDAC; Supplier1: Digikey; Supplier1_PN: 151-1206-1-ND
L4 = Ferrite: as L12 on sheet Power; HelpURL: *; NI: *; Supplier1: Digikey; Supplier1_PN: MH2029-101YCT-ND; Tolerance: *; Type: *
R5 R38 = Resistor: Mfg: Yageo; Mfg_PN: RC0603JR-074K7L; HelpURL: *; NI: *; Supplier1: Digikey; Supplier1_PN: 311-4.7KGRCT-ND; Type: *; Rating: *; Tolerance: *
R39 = Resistor: Mfg: Yageo; Mfg_PN: RC0603JR-071KL; HelpURL: *; NI: *; Supplier1: Digikey; Supplier1_PN: 311-1.0KGRCT-ND; Type: *; Rating: *; Tolerance: *
R40 = Resistor: Mfg: Yageo; Mfg_PN: RC0603FR-0743R2L; HelpURL: *; NI: *; Supplier1: Digikey; Supplier1_PN: 311-43.2HRCT-ND; Type: *; Rating: *; Tolerance: *
R46 R47 R67 R801 R802 = Resistor: Mfg: Yageo; Mfg_PN: RC0603JR-0733RL; HelpURL: *; NI: *; Supplier1: Digikey; Supplier1_PN: 311-33GRCT-ND; Type: *; Rating: *; Tolerance: *
R68 = Resistor: Mfg: Yageo; Mfg_PN: RC0603JR-0710KL; HelpURL: *; NI: *; Supplier1: Digikey; Supplier1_PN: 311-10KGRCT-ND; Type: *; Rating: *; Tolerance: *
TP13 = TESTPOINT: Test point; Mfg: TE; Mfg_PN: RCU-0C; HelpURL: *; NI: *; Rating: *; Supplier1: Digikey; Supplier1_PN: A106145CT-ND; Tolerance: *; Type: *; Value: *
U4 = XMOS_XEF216-512-TQ128: 32-bit multicore microcontroller. 2 Tiles. 16 Logical Cores. 512KB SRAM. 1000MIPS. TQFP128.; Mfg: XMOS; Supplier1: Digikey; Supplier1_PN: 880-1100-ND
U12 = USBLC6-2: USB overvoltage protection; Mfg: ST; HelpURL: http://www.st.com/web/en/resource/technical/document/datasheet/CD00050750.pdf; Mfg_PN: USBLC6-2; NI: *; Supplier1: Digikey; Supplier1_PN: 497-5026-2-ND; Type: *

## Sheet XMOS_power.SchDoc
size Tabloid; DocumentNumber: 3; SheetNumber: 3; SheetTotal: 11; SheetName: XMOS power supply
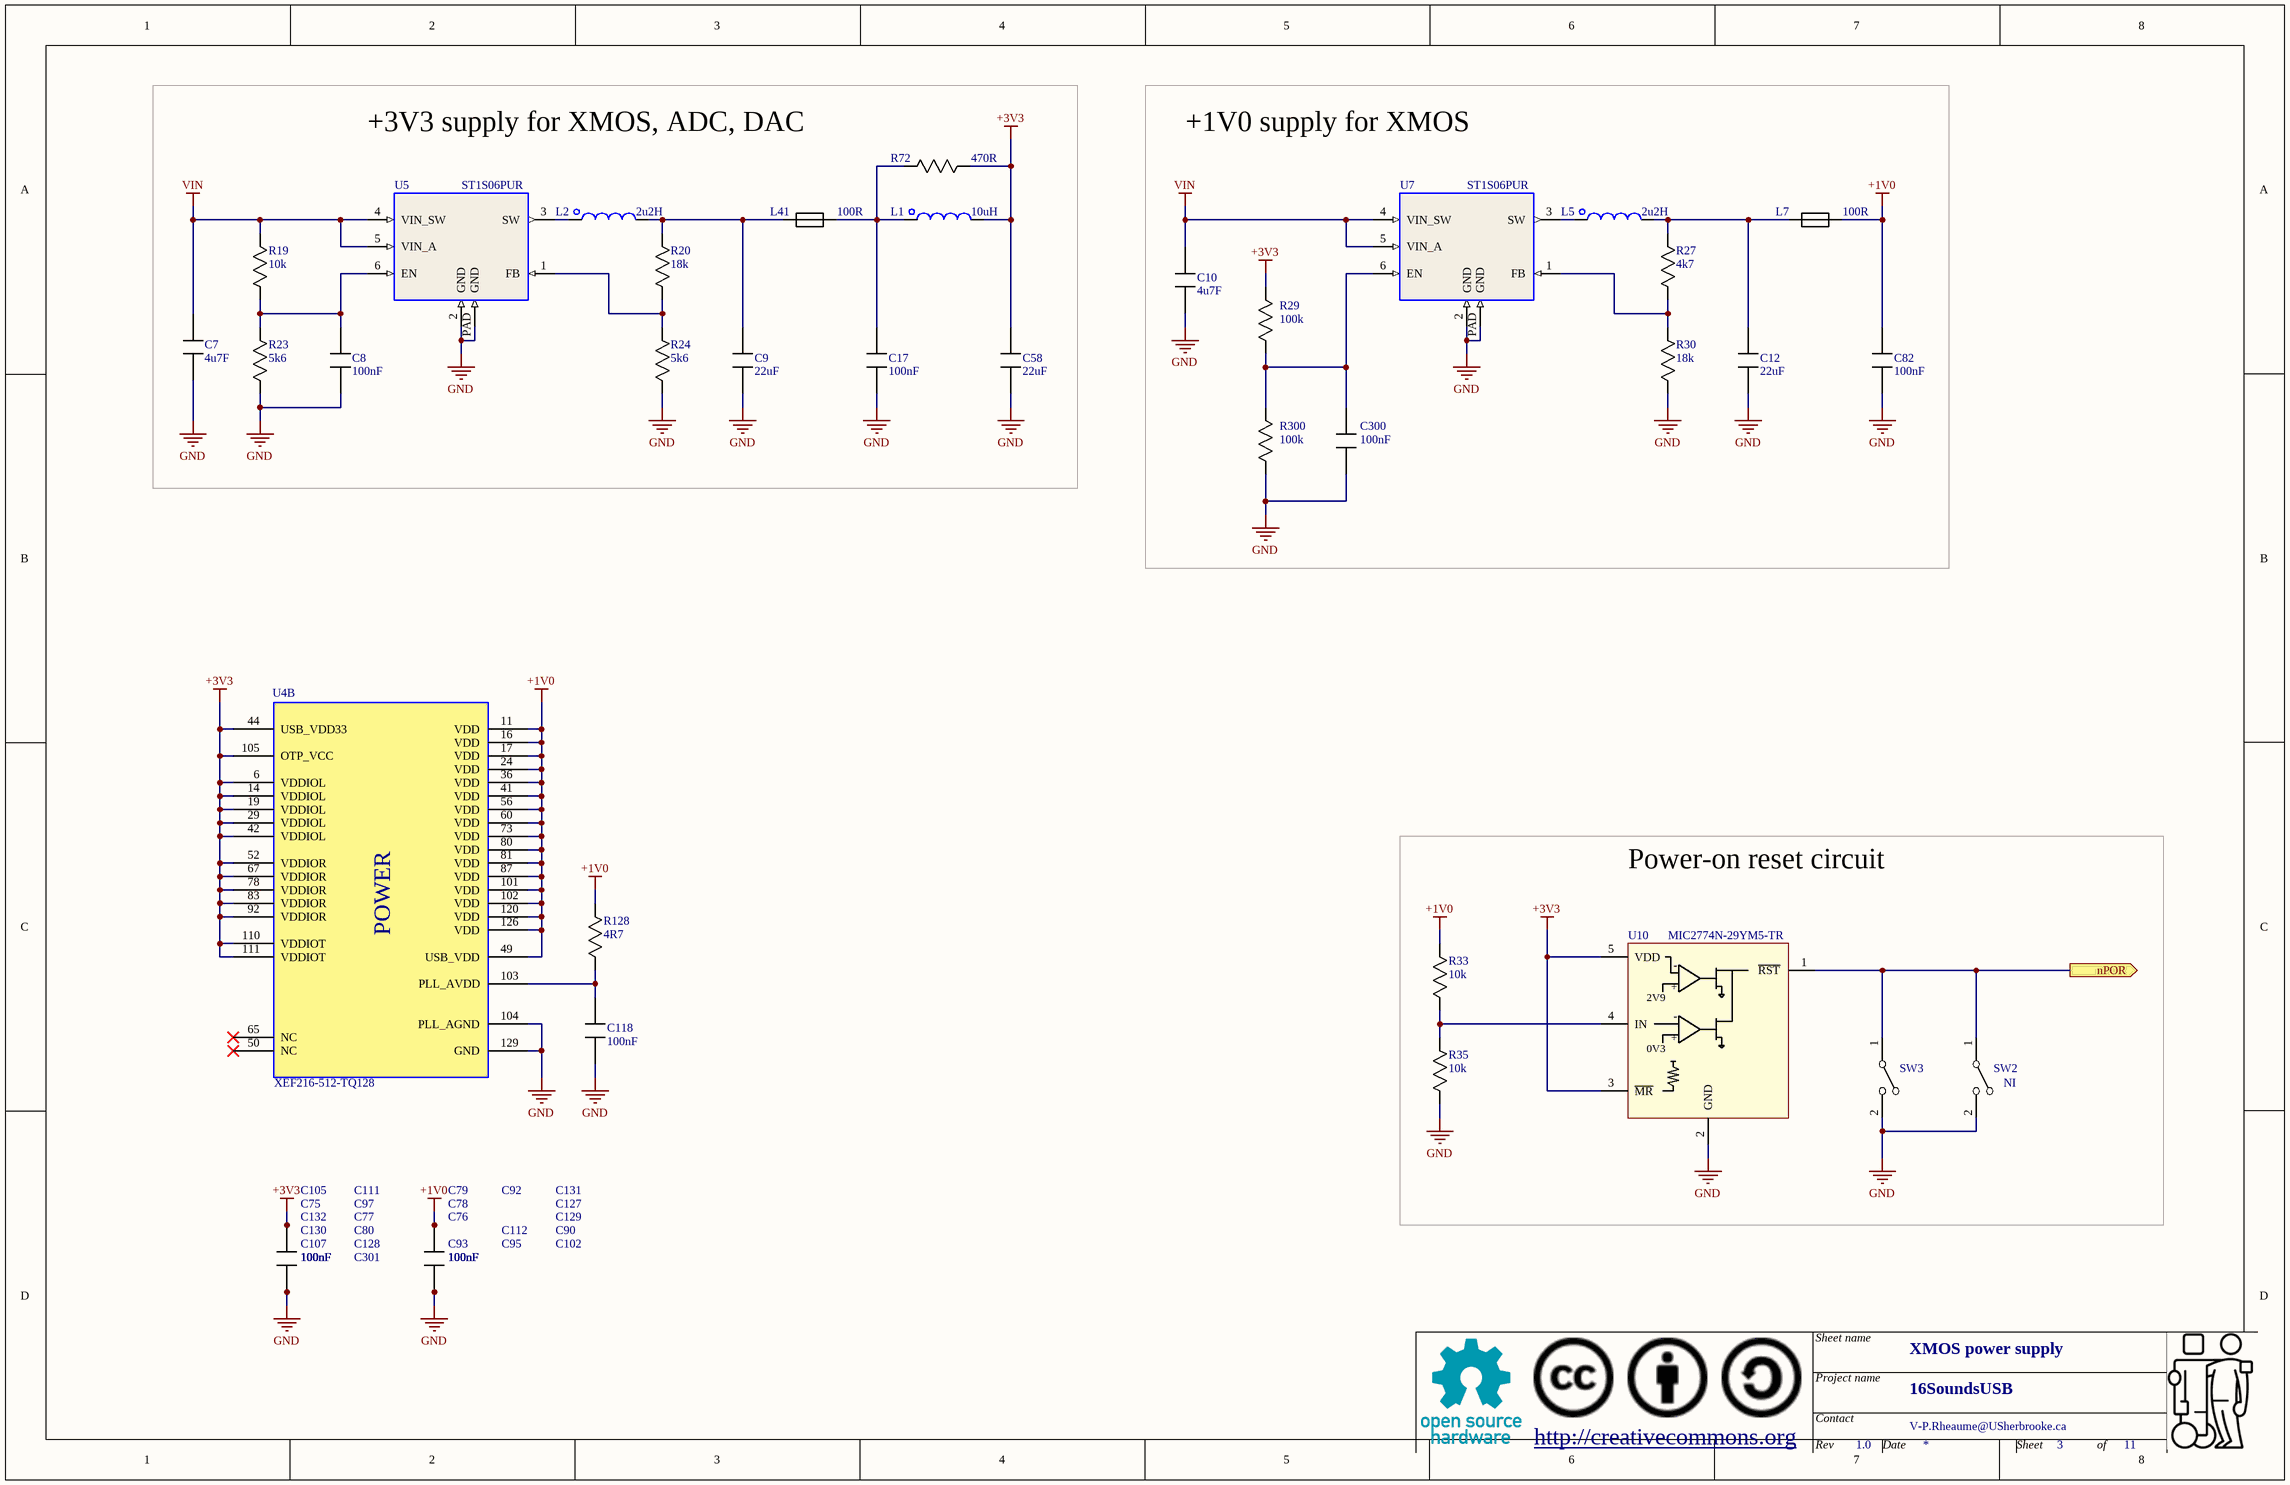
[diagram p3: XMOS_power.SchDoc]

### Parts
C7  value 4u7F  [0805]  (hidden comment: Capacitor)
C8  value 100nF  [0603]  (hidden comment: Capacitor)
C9  value 22uF  [1206]  (hidden comment: Capacitor)
C10  value 4u7F  [0805]  (hidden comment: Capacitor)
C12  value 22uF  [1206]  (hidden comment: Capacitor)
C17  value 100nF  [0603]  (hidden comment: Capacitor)
C58  value 22uF  [1206]  (hidden comment: Capacitor)
C75  value 100nF  [0603]  (hidden comment: Capacitor)
C76  value 100nF  [0603]  (hidden comment: Capacitor)
C77  value 100nF  [0603]  (hidden comment: Capacitor)
C78  value 100nF  [0603]  (hidden comment: Capacitor)
C79  value 100nF  [0603]  (hidden comment: Capacitor)
C80  value 100nF  [0603]  (hidden comment: Capacitor)
C82  value 100nF  [0603]  (hidden comment: Capacitor)
C90  value 100nF  [0603]  (hidden comment: Capacitor)
C92  value 100nF  [0603]  (hidden comment: Capacitor)
C93  value 100nF  [0603]  (hidden comment: Capacitor)
C95  value 100nF  [0603]  (hidden comment: Capacitor)
C97  value 100nF  [0603]  (hidden comment: Capacitor)
C102  value 100nF  [0603]  (hidden comment: Capacitor)
C105  value 100nF  [0603]  (hidden comment: Capacitor)
C107  value 100nF  [0603]  (hidden comment: Capacitor)
C111  value 100nF  [0603]  (hidden comment: Capacitor)
C112  value 100nF  [0603]  (hidden comment: Capacitor)
C118  value 100nF  [0603]  (hidden comment: Capacitor)
C127  value 100nF  [0603]  (hidden comment: Capacitor)
C128  value 100nF  [0603]  (hidden comment: Capacitor)
C129  value 100nF  [0603]  (hidden comment: Capacitor)
C130  value 100nF  [0603]  (hidden comment: Capacitor)
C131  value 100nF  [0603]  (hidden comment: Capacitor)
C132  value 100nF  [0603]  (hidden comment: Capacitor)
C300  value 100nF  [0603]  (hidden comment: Capacitor)
C301  value 100nF  [0603]  (hidden comment: Capacitor)
L1  value 10uH  [IND_252012CDMC/DS]  (hidden comment: Inductor)
L2  value 2u2H  [IND_252012CDMC/DS]  (hidden comment: Inductor)
L5  value 2u2H  [IND_252012CDMC/DS]  (hidden comment: Inductor)
L7  value 100R  [0805]  (hidden comment: Ferrite)
L41  value 100R  [0805]  (hidden comment: Ferrite)
R19  value 10k  [0603]  (hidden comment: Resistor)
R20  value 18k  [0603]  (hidden comment: Resistor)
R23  value 5k6  [0603]  (hidden comment: Resistor)
R24  value 5k6  [0603]  (hidden comment: Resistor)
R27  value 4k7  [0603]  (hidden comment: Resistor)
R29  value 100k  [0603]  (hidden comment: Resistor)
R30  value 18k  [0603]  (hidden comment: Resistor)
R33  value 10k  [0603]  (hidden comment: Resistor)
R35  value 10k  [0603]  (hidden comment: Resistor)
R72  value 470R  [0603]  (hidden comment: Resistor)
R128  value 4R7  [0603]  (hidden comment: Resistor)
R300  value 100k  [0603]  (hidden comment: Resistor)
SW2  Button  [BUTTON_WS-TASV]  (value not drawn)
SW3  Button  [BUTTON_WS-TASV]  (value not drawn)
U4  Mfg_PN: XEF216-512-TQ128  [TQFP128_XMOS]  (part B of 5)
U5  ST1S06PUR  [DFN6_ST1S06]
U7  ST1S06PUR  [DFN6_ST1S06]
U10  MIC2774N-29YM5-TR  [SOT23_5]

### Blocks framed on the sheet
+3V3 supply for XMOS, ADC, DAC: C7-C9 C17 C58 L1 L2 L41 R19 R20 R23 R24 R72 U5
+1V0 supply for XMOS: C10 C12 C82 C300 L5 L7 R27 R29 R30 R300 U7
Power-on reset circuit: R33 R35 SW2 SW3 U10

### Ports
nPOR (out)

### Nets
+1V0: C76.1 C78.1 C79.1 C82.1 C90.1 C92.1 C93.1 C95.1 C102.1 C112.1 C127.1 C129.1 C131.1 L7.2 R33.1 R128.1 U4.11(VDD) U4.16(VDD) U4.17(VDD) U4.24(VDD) U4.36(VDD) U4.41(VDD) U4.49(USB_VDD) U4.56(VDD) U4.60(VDD) U4.73(VDD) U4.80(VDD) U4.81(VDD) U4.87(VDD) U4.101(VDD) U4.102(VDD) U4.120(VDD) U4.126(VDD)
+3V3: C58.1 C75.1 C77.1 C80.1 C97.1 C105.1 C107.1 C111.1 C128.1 C130.1 C132.1 C301.1 L1.2 R29.1 R72.1 U4.6(VDDIOL) U4.14(VDDIOL) U4.19(VDDIOL) U4.29(VDDIOL) U4.42(VDDIOL) U4.44(USB_VDD33) U4.52(VDDIOR) U4.67(VDDIOR) U4.78(VDDIOR) U4.83(VDDIOR) U4.92(VDDIOR) U4.105(OTP_VCC) U4.110(VDDIOT) U4.111(VDDIOT) U10.3(~{MR}) U10.5(VDD)
GND: C7.2 C8.2 C9.2 C10.2 C12.2 C17.2 C58.2 C75.2 C76.2 C77.2 C78.2 C79.2 C80.2 C82.2 C90.2 C92.2 C93.2 C95.2 C97.2 C102.2 C105.2 C107.2 C111.2 C112.2 C118.2 C127.2 C128.2 C129.2 C130.2 C131.2 C132.2 C300.2 C301.2 R23.2 R24.2 R30.2 R35.2 R300.2 SW2.2 SW3.2 U4.104(PLL_AGND) U4.129(GND) U5.2(GND) U5.PAD(GND) U7.2(GND) U7.PAD(GND) U10.2(GND)
VIN: C7.1 C10.1 R19.1 U5.4(VIN_SW) U5.5(VIN_A) U7.4(VIN_SW) U7.5(VIN_A)
NetC8_1: C8.1 R19.2 R23.1 U5.6(EN)
NetC9_1: C9.1 L2.2 L41.1 R20.1
NetC12_1: C12.1 L5.2 L7.1 R27.1
NetC17_1: C17.1 L1.1 L41.2 R72.2
NetC118_1: C118.1 R128.2 U4.103(PLL_AVDD)
NetC300_1: C300.1 R29.2 R300.1 U7.6(EN)
NetD4_2: SW2.1 SW3.1 U10.1(~{RST}) ; port nPOR
NetL2_1: L2.1 U5.3(SW)
NetL5_1: L5.1 U7.3(SW)
NetR20_2: R20.2 R24.1 U5.1(FB)
NetR27_2: R27.2 R30.1 U7.1(FB)
NetR33_2: R33.2 R35.1 U10.4(IN)

Not connected (* = marked no-connect by the designer): SW2 3 4; SW3 3 4; U4 50(NC)* 65(NC)*

### Notes on the sheet
- Sheet name
- http://creativecommons.org
- Project name
- Contact
- Rev
- Date
- Sheet
- of
- (in symbol MIC2774N-29YM5-TR) -; +; 2V9; 0V3
- (in symbol XMOS_XEF216-512-TQ128, part B) POWER

### Library data of the parts
C7 C10 = Capacitor: Mfg: Samsung; Mfg_PN: CL21A475KAQNNNG; HelpURL: *; NI: *; Supplier1: Digikey; Supplier1_PN: 1276-6462-1-ND; Tolerance: *; Type: *; Rating: *
C8 C17 C75-C80 C82 C90 C92 C93 C95 C97 C102 C105 C107 C111 C112 C118 C127-C132 C300 C301 = Capacitor: Mfg: Samsung; Mfg_PN: CL10F104ZO8NNNC; HelpURL: *; NI: *; Supplier1: Digikey; Supplier1_PN: 1276-1258-1-ND; Tolerance: *; Type: *; Rating: *
C9 C12 C58 = Capacitor: Mfg: Samsung; Mfg_PN: CL31F226ZPHNNNE; HelpURL: *; NI: *; Supplier1: Digikey; Supplier1_PN: 1276-3296-1-ND; Tolerance: *; Type: *; Rating: *
L1 = Inductor: Mfg: Murata; Mfg_PN: DFE252012F-100M=P2; HelpURL: *; NI: *; Rating: *; Tolerance: *; Supplier1: Digikey; Supplier1_PN: 490-13050-1-ND
L2 L5 = Inductor: Mfg: Murata; Mfg_PN: DFE252012F-2R2M=P2; HelpURL: *; NI: *; Rating: *; Tolerance: *; Supplier1: Digikey; Supplier1_PN: 490-13055-1-ND
L7 L41 = Ferrite: as L12 on sheet Power; HelpURL: *; NI: *; Supplier1: Digikey; Supplier1_PN: MH2029-101YCT-ND; Tolerance: *; Type: *
R19 R33 R35 = Resistor: Mfg: Yageo; Mfg_PN: RC0603JR-0710KL; HelpURL: *; NI: *; Supplier1: Digikey; Supplier1_PN: 311-10KGRCT-ND; Type: *; Rating: *; Tolerance: *
R20 R30 = Resistor: Mfg: Yageo; Mfg_PN: RC0603JR-0718KL; HelpURL: *; NI: *; Supplier1: Digikey; Supplier1_PN: 311-18KGRCT-ND; Type: *; Rating: *; Tolerance: *
R23 R24 = Resistor: Mfg: Yageo; Mfg_PN: RC0603JR-075K6L; HelpURL: *; NI: *; Supplier1: Digikey; Supplier1_PN: 311-5.6KGRCT-ND; Type: *; Rating: *; Tolerance: *
R27 = Resistor: Mfg: Yageo; Mfg_PN: RC0603JR-074K7L; HelpURL: *; NI: *; Supplier1: Digikey; Supplier1_PN: 311-4.7KGRCT-ND; Type: *; Rating: *; Tolerance: *
R29 R300 = Resistor: Mfg: Yageo; Mfg_PN: 311-10GRCT-ND; HelpURL: *; NI: *; Supplier1: Digikey; Supplier1_PN: 311-100KGRCT-ND; Type: *; Rating: *; Tolerance: *
R72 = Resistor: Mfg: Yageo; Mfg_PN: RC0603JR-07470RL; HelpURL: *; NI: *; Supplier1: Digikey; Supplier1_PN: 311-470GRCT-ND; Type: *; Rating: *; Tolerance: *
R128 = Resistor: Mfg: Yageo; Mfg_PN: RC0603JR-074R7L; HelpURL: *; NI: *; Supplier1: Digikey; Supplier1_PN: 311-4.7GRCT-ND; Type: *; Rating: *; Tolerance: *
SW2 SW3 = Button: Mfg: Wurth; Mfg_PN: 430152050826; HelpURL: *; Rating: *; Tolerance: *; Value: *; Supplier1: Digikey; Supplier1_PN: 732-6993-1-ND
  SW2: NI: NI
  SW3: NI: *
U4 = XMOS_XEF216-512-TQ128: as U4 on sheet XMOS_chip; Supplier1: Digikey; Supplier1_PN: 880-1100-ND
U5 U7 = ST1S06PUR: DC-DC Buck Converter, 1.5A, 1.5MHz, DFN6; Mfg: ST Microelectronics; Mfg_PN: ST1S06PUR; Supplier1: Digikey; Supplier1_PN: 497-5802-1-ND
U10 = MIC2774N-29YM5-TR: Voltage supervisor and power-on timer, dual; Mfg: Micrel; HelpURL: *; Mfg_PN: MIC2774N-29YM5-TR; NI: *; Rating: *; Supplier1: Digikey; Supplier1_PN: 576-1101-1-ND; Tolerance: *; Type: *; Value: *

## Sheet AudioInputs_8.SchDoc
size Tabloid; DocumentNumber: 10; SheetNumber: 10; SheetTotal: 11; SheetName: Analog input (group)
Used 2 times, as channels AudioInputs_9-15, AudioInputs_1-8. Parts and nets are listed once, with the designators drawn on the sheet.
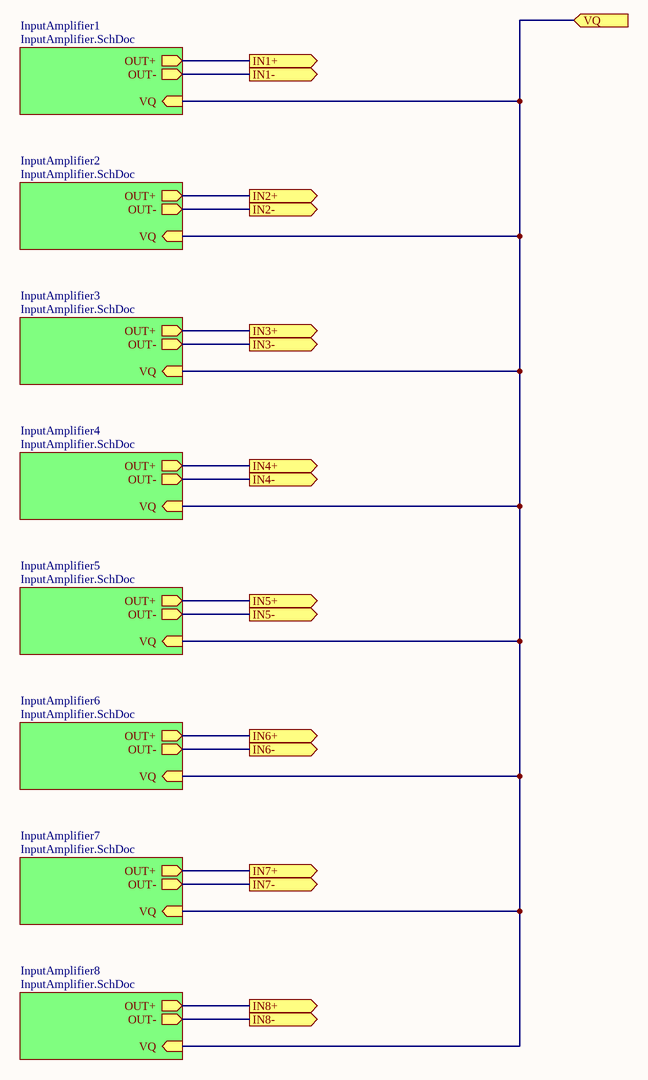
[diagram p4: AudioInputs_8.SchDoc]

### Sub-sheets
InputAmplifier1 = InputAmplifier.SchDoc: VQ (in), OUT+ (out), OUT- (out)
InputAmplifier2 = InputAmplifier.SchDoc: VQ (in), OUT+ (out), OUT- (out)
InputAmplifier3 = InputAmplifier.SchDoc: VQ (in), OUT+ (out), OUT- (out)
InputAmplifier4 = InputAmplifier.SchDoc: VQ (in), OUT+ (out), OUT- (out)
InputAmplifier5 = InputAmplifier.SchDoc: VQ (in), OUT+ (out), OUT- (out)
InputAmplifier6 = InputAmplifier.SchDoc: VQ (in), OUT+ (out), OUT- (out)
InputAmplifier7 = InputAmplifier.SchDoc: VQ (in), OUT+ (out), OUT- (out)
InputAmplifier8 = InputAmplifier.SchDoc: VQ (in), OUT+ (out), OUT- (out)

### Ports
IN1+ (out), IN1- (out), IN2+ (out), IN2- (out), IN3+ (out), IN3- (out), IN4+ (out), IN4- (out), IN5+ (out), IN5- (out), IN6+ (out), IN6- (out), IN7+ (out), IN7- (out), IN8+ (out), IN8- (out), VQ (in)

### Nets
IN1+: port IN1+, sheet InputAmplifier1/OUT+
IN1-: port IN1-, sheet InputAmplifier1/OUT-
IN2+: port IN2+, sheet InputAmplifier2/OUT+
IN2-: port IN2-, sheet InputAmplifier2/OUT-
IN3+: port IN3+, sheet InputAmplifier3/OUT+
IN3-: port IN3-, sheet InputAmplifier3/OUT-
IN4+: port IN4+, sheet InputAmplifier4/OUT+
IN4-: port IN4-, sheet InputAmplifier4/OUT-
IN5+: port IN5+, sheet InputAmplifier5/OUT+
IN5-: port IN5-, sheet InputAmplifier5/OUT-
IN6+: port IN6+, sheet InputAmplifier6/OUT+
IN6-: port IN6-, sheet InputAmplifier6/OUT-
IN7+: port IN7+, sheet InputAmplifier7/OUT+
IN7-: port IN7-, sheet InputAmplifier7/OUT-
IN8+: port IN8+, sheet InputAmplifier8/OUT+
IN8-: port IN8-, sheet InputAmplifier8/OUT-
VQ: port VQ, sheet InputAmplifier1/VQ, sheet InputAmplifier2/VQ, sheet InputAmplifier3/VQ, sheet InputAmplifier4/VQ, sheet InputAmplifier5/VQ, sheet InputAmplifier6/VQ, sheet InputAmplifier7/VQ, sheet InputAmplifier8/VQ

### Channels
AudioInputs_9-15: ports IN1+=IN9_P IN1-=IN9_N IN2+=IN10_P IN2-=IN10_N IN3+=IN11_P IN3-=IN11_N IN4+=IN12_P IN4-=IN12_N IN5+=IN13_P IN5-=IN13_N IN6+=IN14_P IN6-=IN14_N IN7+=IN15_P IN7-=IN15_N IN8+=IN16_P IN8-=IN16_N VQ=ADC2_VQ
AudioInputs_1-8: ports IN1+=IN1_P IN1-=IN1_N IN2+=IN2_P IN2-=IN2_N IN3+=IN3_P IN3-=IN3_N IN4+=IN4_P IN4-=IN4_N IN5+=IN5_P IN5-=IN5_N IN6+=IN6_P IN6-=IN6_N IN7+=IN7_P IN7-=IN7_N IN8+=IN8_P IN8-=IN8_N VQ=ADC1_VQ

### Notes on the sheet
- Sheet name
- http://creativecommons.org
- Project name
- Contact
- Rev
- Date
- Sheet
- of

## Sheet InputAmplifier.SchDoc
size Tabloid; DocumentNumber: 11; SheetNumber: 11; SheetTotal: 11; SheetName: Audio input amplifier
Used 16 times, as channels AudioInputs_9-15/InputAmplifier1, AudioInputs_9-15/InputAmplifier2, AudioInputs_9-15/InputAmplifier3, AudioInputs_9-15/InputAmplifier4, AudioInputs_9-15/InputAmplifier5, AudioInputs_9-15/InputAmplifier6, AudioInputs_9-15/InputAmplifier7, AudioInputs_9-15/InputAmplifier8, AudioInputs_1-8/InputAmplifier1, AudioInputs_1-8/InputAmplifier2, AudioInputs_1-8/InputAmplifier3, AudioInputs_1-8/InputAmplifier4, AudioInputs_1-8/InputAmplifier5, AudioInputs_1-8/InputAmplifier6, AudioInputs_1-8/InputAmplifier7, AudioInputs_1-8/InputAmplifier8. Parts and nets are listed once, with the designators drawn on the sheet.
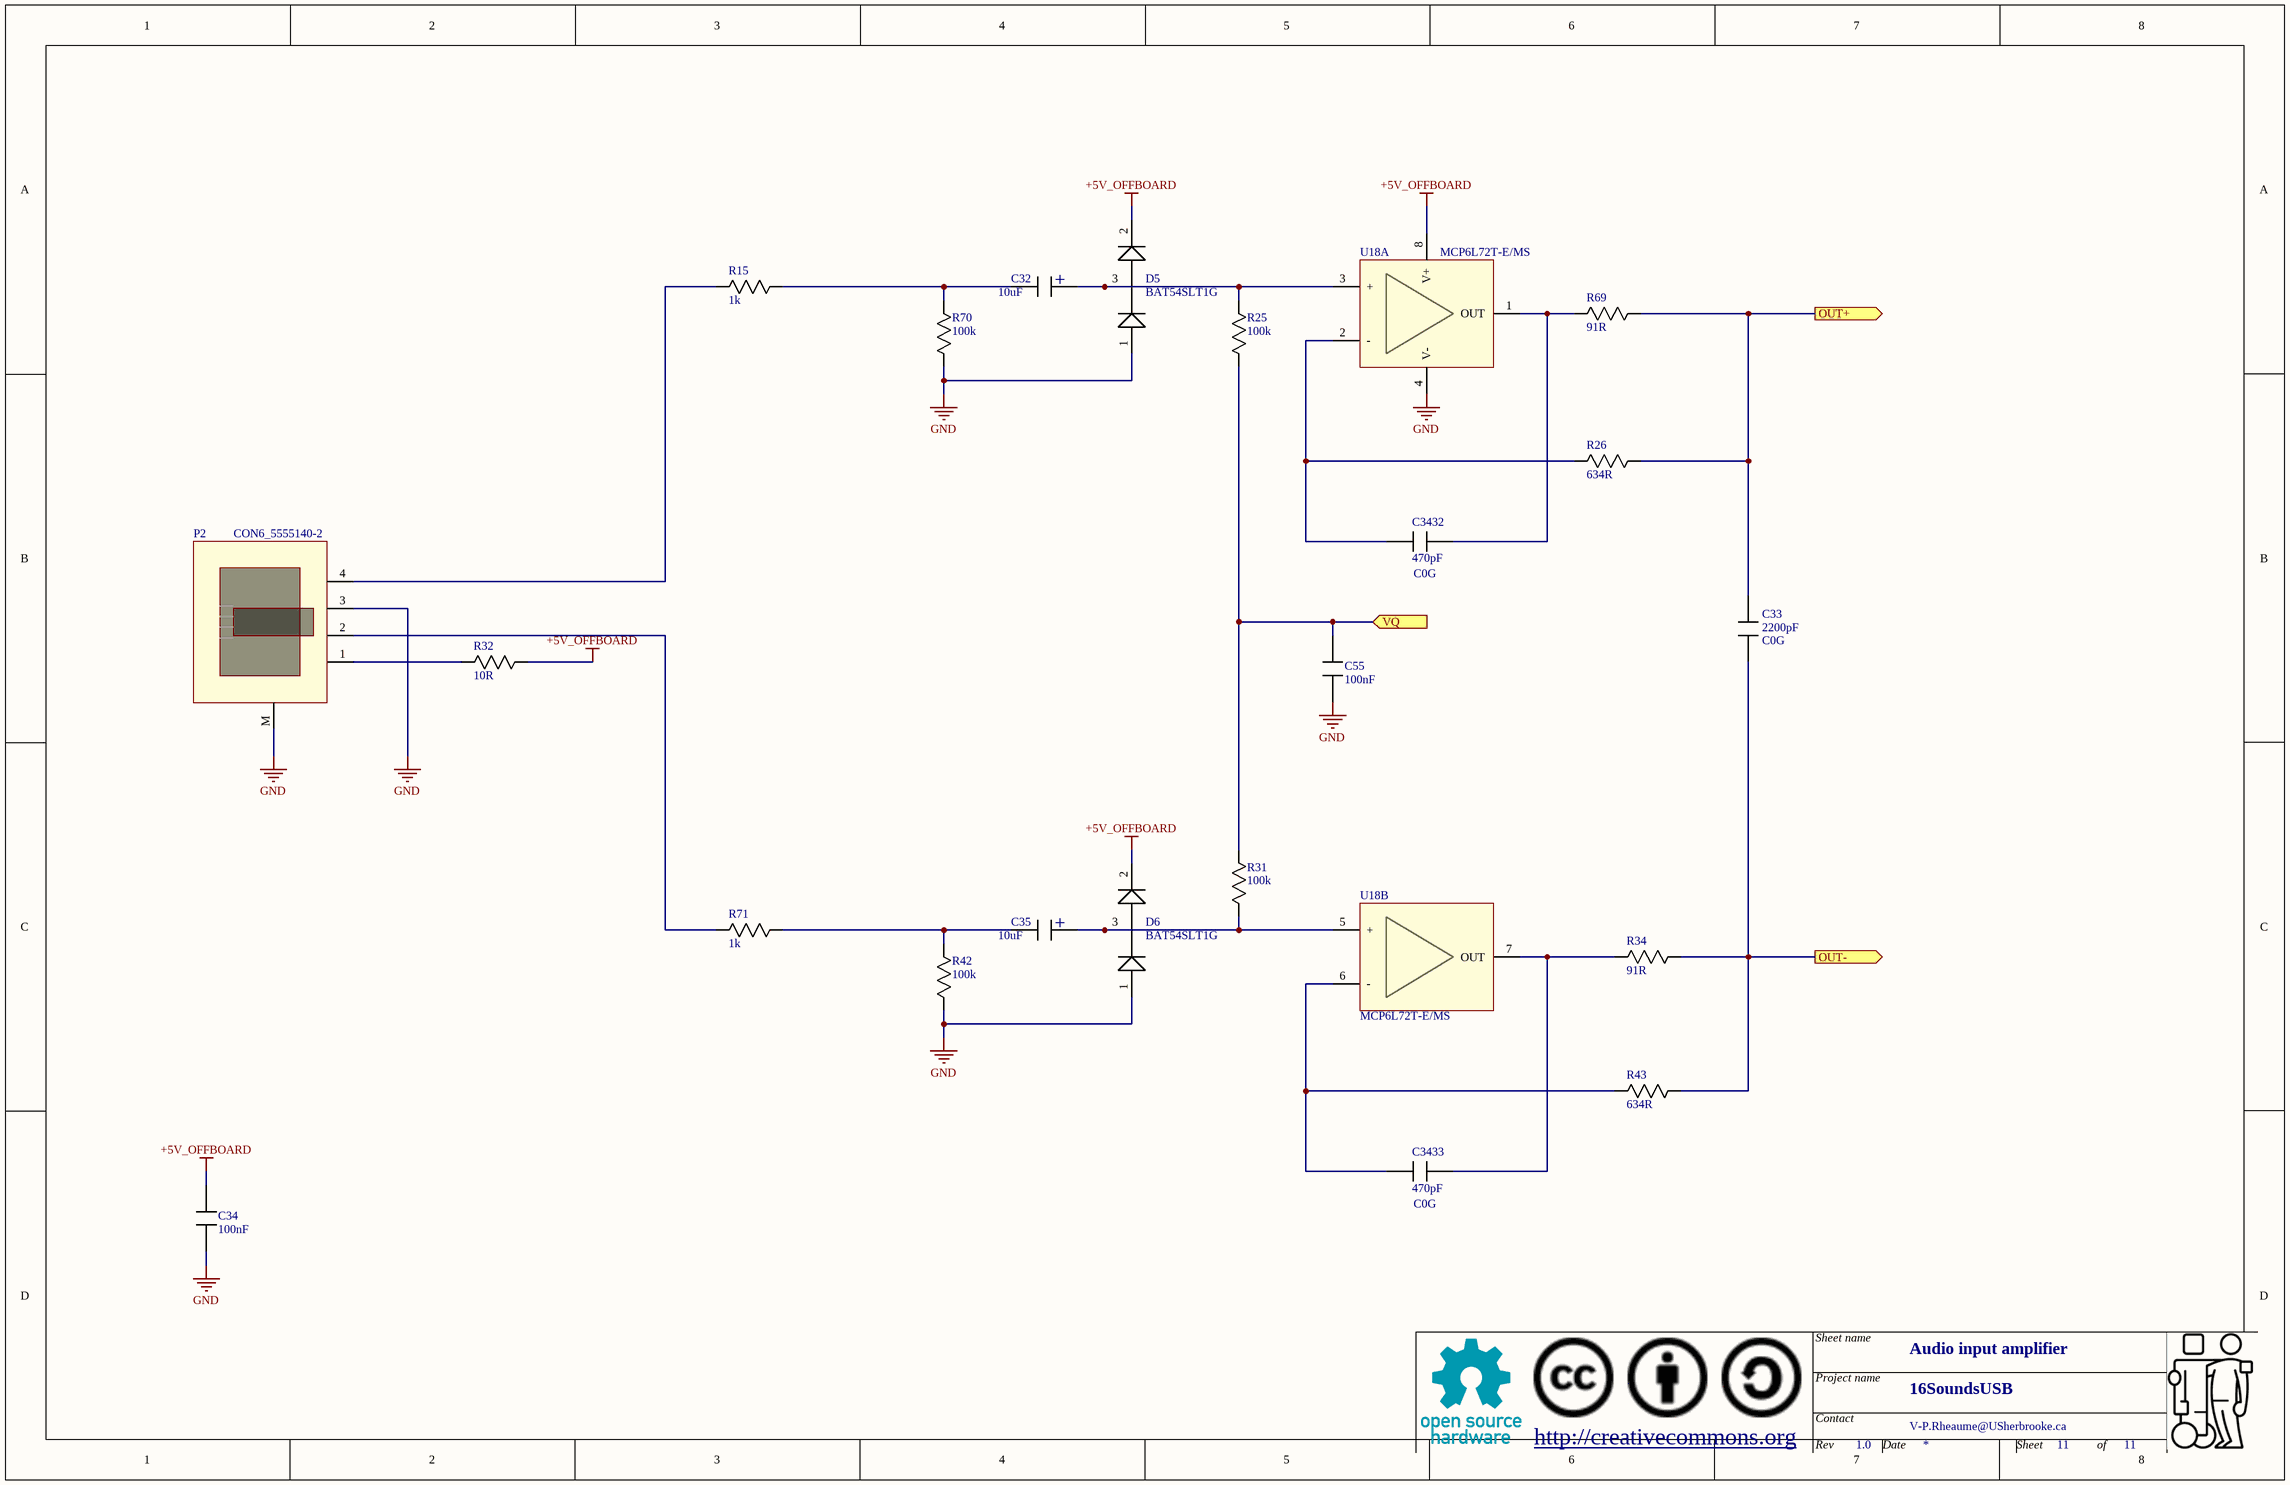
[diagram p5: InputAmplifier.SchDoc]

### Parts
C32  value 10uF  [CAP_RAD_SMD_DIA157]  (hidden comment: Capacitor_Polarized)
C33  value 2200pF  Type: C0G  [0603]  (hidden comment: Capacitor)
C34  value 100nF  [0603]  (hidden comment: Capacitor)
C35  value 10uF  [CAP_RAD_SMD_DIA157]  (hidden comment: Capacitor_Polarized)
C55  value 100nF  [0603]  (hidden comment: Capacitor)
C3432  value 470pF  Type: C0G  [0603]  (hidden comment: Capacitor)
C3433  value 470pF  Type: C0G  [0603]  (hidden comment: Capacitor)
D5  Mfg_PN: BAT54SLT1G  [SOT23_132]  (hidden comment: Diode_dual)
D6  Mfg_PN: BAT54SLT1G  [SOT23_132]  (hidden comment: Diode_dual)
P2  CON6_5555140-2  [CONN4_5555140-2]
R15  value 1k  [0603]  (hidden comment: Resistor)
R25  value 100k  [0603]  (hidden comment: Resistor)
R26  value 634R  [0603]  (hidden comment: Resistor)
R31  value 100k  [0603]  (hidden comment: Resistor)
R32  value 10R  [0603]  (hidden comment: Resistor)
R34  value 91R  [0603]  (hidden comment: Resistor)
R42  value 100k  [0603]  (hidden comment: Resistor)
R43  value 634R  [0603]  (hidden comment: Resistor)
R69  value 91R  [0603]  (hidden comment: Resistor)
R70  value 100k  [0603]  (hidden comment: Resistor)
R71  value 1k  [0603]  (hidden comment: Resistor)
U18  Mfg_PN: MCP6L72T-E/MS  [SOP127P600-8N]  (hidden comment: OPA_DUAL)  (parts A,B of 2)

### Ports
OUT+ (out), OUT- (out), VQ (in)

### Nets
+5V_OFFBOARD: C34.1 D5.2(K) D6.2(K) R32.2 U18.8(V+)
GND: C34.2 C55.2 D5.1(K) D6.1(K) P2.3 P2.M R42.1 R70.1 U18.4(V-)
OUT+: C33.1 R26.2 R69.2 ; port OUT+
OUT-: C33.2 R34.2 R43.2 ; port OUT-
VQ: C55.1 R25.1 R31.2 ; port VQ
NetC32_+: C32.+ D5.3(AK) R25.2 U18.3(+)
NetC32_-: C32.- R15.2 R70.2
NetC35_+: C35.+ D6.3(AK) R31.1 U18.5(+)
NetC35_-: C35.- R42.2 R71.2
NetC3432_1: C3432.1 R26.1 U18.2(-)
NetC3432_2: C3432.2 R69.1 U18.1(OUT)
NetC3433_1: C3433.1 R43.1 U18.6(-)
NetC3433_2: C3433.2 R34.1 U18.7(OUT)
NetP2_1: P2.1 R32.1
NetP2_2: P2.2 R71.1
NetP2_4: P2.4 R15.1

### Channels
AudioInputs_9-15/InputAmplifier1: designators end in _AudioInputs_9-15_InputAmplifier1; ports OUT+=IN9_P OUT-=IN9_N VQ=ADC2_VQ
AudioInputs_9-15/InputAmplifier2: designators end in _AudioInputs_9-15_InputAmplifier2; ports OUT+=IN10_P OUT-=IN10_N VQ=ADC2_VQ
AudioInputs_9-15/InputAmplifier3: designators end in _AudioInputs_9-15_InputAmplifier3; ports OUT+=IN11_P OUT-=IN11_N VQ=ADC2_VQ
AudioInputs_9-15/InputAmplifier4: designators end in _AudioInputs_9-15_InputAmplifier4; ports OUT+=IN12_P OUT-=IN12_N VQ=ADC2_VQ
AudioInputs_9-15/InputAmplifier5: designators end in _AudioInputs_9-15_InputAmplifier5; ports OUT+=IN13_P OUT-=IN13_N VQ=ADC2_VQ
AudioInputs_9-15/InputAmplifier6: designators end in _AudioInputs_9-15_InputAmplifier6; ports OUT+=IN14_P OUT-=IN14_N VQ=ADC2_VQ
AudioInputs_9-15/InputAmplifier7: designators end in _AudioInputs_9-15_InputAmplifier7; ports OUT+=IN15_P OUT-=IN15_N VQ=ADC2_VQ
AudioInputs_9-15/InputAmplifier8: designators end in _AudioInputs_9-15_InputAmplifier8; ports OUT+=IN16_P OUT-=IN16_N VQ=ADC2_VQ
AudioInputs_1-8/InputAmplifier1: designators end in _AudioInputs_1-8_InputAmplifier1; ports OUT+=IN1_P OUT-=IN1_N VQ=ADC1_VQ
AudioInputs_1-8/InputAmplifier2: designators end in _AudioInputs_1-8_InputAmplifier2; ports OUT+=IN2_P OUT-=IN2_N VQ=ADC1_VQ
AudioInputs_1-8/InputAmplifier3: designators end in _AudioInputs_1-8_InputAmplifier3; ports OUT+=IN3_P OUT-=IN3_N VQ=ADC1_VQ
AudioInputs_1-8/InputAmplifier4: designators end in _AudioInputs_1-8_InputAmplifier4; ports OUT+=IN4_P OUT-=IN4_N VQ=ADC1_VQ
AudioInputs_1-8/InputAmplifier5: designators end in _AudioInputs_1-8_InputAmplifier5; ports OUT+=IN5_P OUT-=IN5_N VQ=ADC1_VQ
AudioInputs_1-8/InputAmplifier6: designators end in _AudioInputs_1-8_InputAmplifier6; ports OUT+=IN6_P OUT-=IN6_N VQ=ADC1_VQ
AudioInputs_1-8/InputAmplifier7: designators end in _AudioInputs_1-8_InputAmplifier7; ports OUT+=IN7_P OUT-=IN7_N VQ=ADC1_VQ
AudioInputs_1-8/InputAmplifier8: designators end in _AudioInputs_1-8_InputAmplifier8; ports OUT+=IN8_P OUT-=IN8_N VQ=ADC1_VQ

### Notes on the sheet
- Sheet name
- http://creativecommons.org
- Project name
- Contact
- Rev
- Date
- Sheet
- of

### Library data of the parts
C32 C35 = Capacitor_Polarized: as C3 on sheet Power; HelpURL: *; NI: *; Supplier1: Digikey; Supplier1_PN: 493-2100-1-ND; Tolerance: *; Type: *; Rating: *
C33 = Capacitor: Mfg: Murata; Mfg_PN: GRM1885C1H222JA01D; HelpURL: *; NI: *; Supplier1: Digikey; Supplier1_PN: 490-1459-1-ND; Tolerance: *; Rating: *
C34 C55 = Capacitor: Mfg: Samsung; Mfg_PN: CL10F104ZO8NNNC; HelpURL: *; NI: *; Supplier1: Digikey; Supplier1_PN: 1276-1258-1-ND; Tolerance: *; Type: *; Rating: *
C3432 C3433 = Capacitor: Mfg: Samsung; Mfg_PN: CL10C471JB8NCNC; HelpURL: *; NI: *; Supplier1: Digikey; Supplier1_PN: 1276-2302-1-ND; Tolerance: *; Rating: *
D5 D6 = Diode_dual: Diode; Mfg: Onsemi; HelpURL: *; NI: *; Supplier1: Digikey; Supplier1_PN: BAT54SLT1GOSCT-ND; Tolerance: *; Type: *; Rating: *; Value: *
P2 = CON6_5555140-2: 6p4c RJ11/RJ14, shielded (5555165-2 unshielded); Mfg: TE; HelpURL: *; Mfg_PN: 5555140-2; NI: *; Rating: *; Supplier1: Digikey; Supplier1_PN: A31436-ND; Tolerance: *; Type: *; Value: *
R15 R71 = Resistor: Mfg: Yageo; Mfg_PN: RC0603JR-071KL; HelpURL: *; NI: *; Supplier1: Digikey; Supplier1_PN: 311-1.0KGRCT-ND; Type: *; Rating: *; Tolerance: *
R25 R31 R42 R70 = Resistor: Mfg: Yageo; Mfg_PN: 311-10GRCT-ND; HelpURL: *; NI: *; Supplier1: Digikey; Supplier1_PN: 311-100KGRCT-ND; Type: *; Rating: *; Tolerance: *
R26 R43 = Resistor: Mfg: Yageo; Mfg_PN: RC0603FR-07634RL; HelpURL: *; NI: *; Supplier1: Digikey; Supplier1_PN: 311-634HRCT-ND; Type: *; Rating: *; Tolerance: *
R32 = Resistor: Mfg: Yageo; Mfg_PN: RC0603JR-0710RL; HelpURL: *; NI: *; Supplier1: Digikey; Supplier1_PN: 311-10GRCT-ND; Type: *; Rating: *; Tolerance: *
R34 R69 = Resistor: Mfg: Yageo; Mfg_PN: RC0603JR-0791RL; HelpURL: *; NI: *; Supplier1: Digikey; Supplier1_PN: 311-91GRCT-ND; Type: *; Rating: *; Tolerance: *
U18 = OPA_DUAL: Dual amplifier (standard); Mfg: Microchip; HelpURL: *; NI: *; Rating: *; Supplier1: Digikey; Supplier1_PN: MCP6L72T-E/MSCT-ND; Tolerance: *; Value: *

## Sheet Clock.SchDoc
size Tabloid; DrawnBy: V-P.Rheaume@USherbrooke.ca; DocumentNumber: 4; SheetNumber: 4; SheetTotal: 11; SheetName: Clock; ProjectTitle: 16SoundsUSB
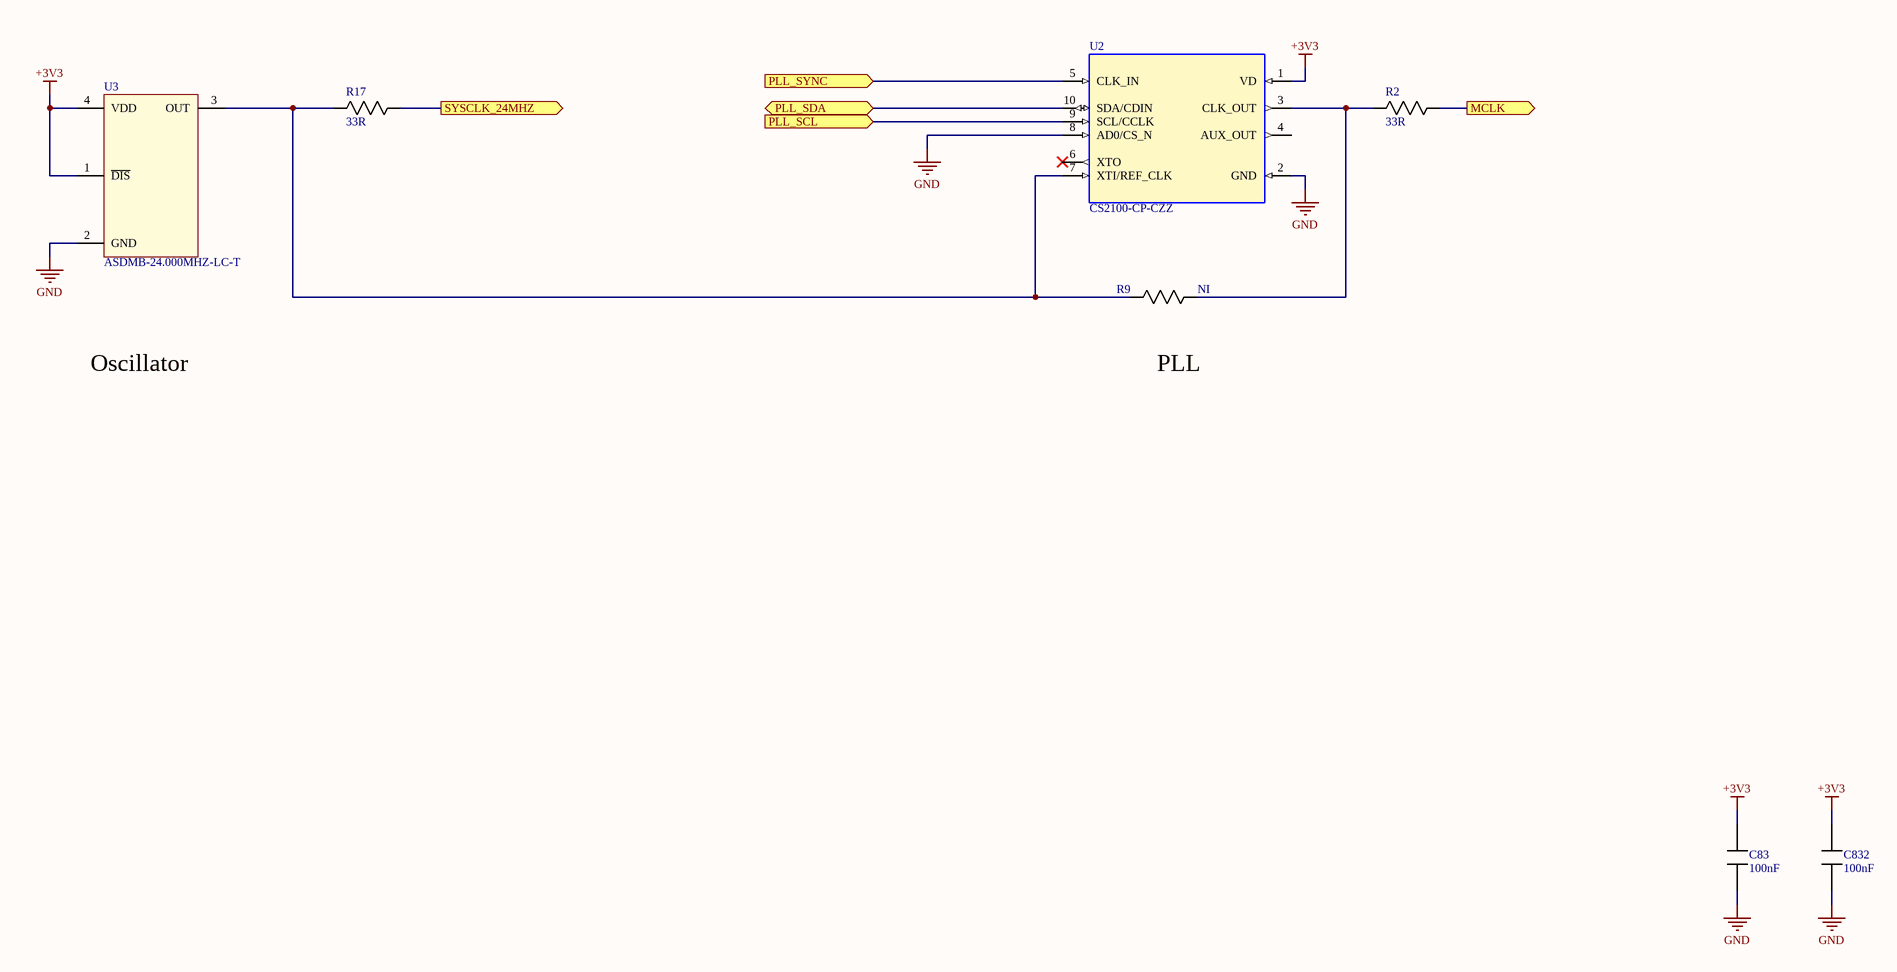
[diagram p6: Clock.SchDoc]

### Parts
C83  value 100nF  [0603]  (hidden comment: Capacitor)
C832  value 100nF  [0603]  (hidden comment: Capacitor)
R2  value 33R  [0603]  (hidden comment: Resistor)
R9  Resistor  [0603]  (value not drawn)
R17  value 33R  [0603]  (hidden comment: Resistor)
U2  Mfg_PN: CS2100-CP-CZZ  [MSOP10]  (hidden comment: CS2100_CP)
U3  Mfg_PN: ASDMB-24.000MHZ-LC-T  [OSC_ADSMB]  (hidden comment: OSC_ASDMB)

### Ports
MCLK (out), PLL_SCL (in), PLL_SDA (bidir), PLL_SYNC (in), SYSCLK_24MHZ (out)

### Nets
+3V3: C83.1 C832.1 U2.1(VD) U3.1(~{DIS}) U3.4(VDD)
GND: C83.2 C832.2 U2.2(GND) U2.8(AD0/CS_N) U3.2(GND)
I2C_SCL: U2.9(SCL/CCLK) ; port PLL_SCL
I2C_SDA: U2.10(SDA/CDIN) ; port PLL_SDA
MCLK_XCORE: R2.2 ; port MCLK
NetR2_1: R2.1 R9.2 U2.3(CLK_OUT)
NetR9_1: R9.1 R17.1 U2.7(XTI/REF_CLK) U3.3(OUT)
NetR17_2: R17.2 ; port SYSCLK_24MHZ
NetU2_5: U2.5(CLK_IN) ; port PLL_SYNC

Not connected (* = marked no-connect by the designer): U2 4(AUX_OUT) 6(XTO)*

### Notes on the sheet
- Oscillator
- PLL
- Sheet name
- http://creativecommons.org
- Project name
- Contact
- Rev
- Date
- Sheet
- of

### Library data of the parts
C83 C832 = Capacitor: Mfg: Samsung; Mfg_PN: CL10F104ZO8NNNC; HelpURL: *; NI: *; Supplier1: Digikey; Supplier1_PN: 1276-1258-1-ND; Tolerance: *; Type: *; Rating: *
R2 R17 = Resistor: Mfg: Yageo; Mfg_PN: RC0603JR-0733RL; HelpURL: *; NI: *; Supplier1: Digikey; Supplier1_PN: 311-33GRCT-ND; Type: *; Rating: *; Tolerance: *
R9 = Resistor: Value: 0R; HelpURL: *; Mfg: *; Mfg_PN: *; NI: NI; Supplier1: *; Supplier1_PN: *; Type: *; Rating: *; Tolerance: *
U2 = CS2100_CP: Fractional-N Clock Multiplier, Crystal Reference, MSOP10; Mfg: Cirrus Logic; Supplier1: Digikey; Supplier1_PN: 598-1750-ND
U3 = OSC_ASDMB: Oscillator; 1V8 to 3V3; Mfg: Abracon; HelpURL: http://www.abracon.com/Oscillators/ASDMB.pdf; Supplier1: Digikey; Supplier1_PN: 535-11728-1-ND; NI: *; Type: 24MHz